# Altium schematic sheet IntegratedShelfControl.SchDoc
size A0
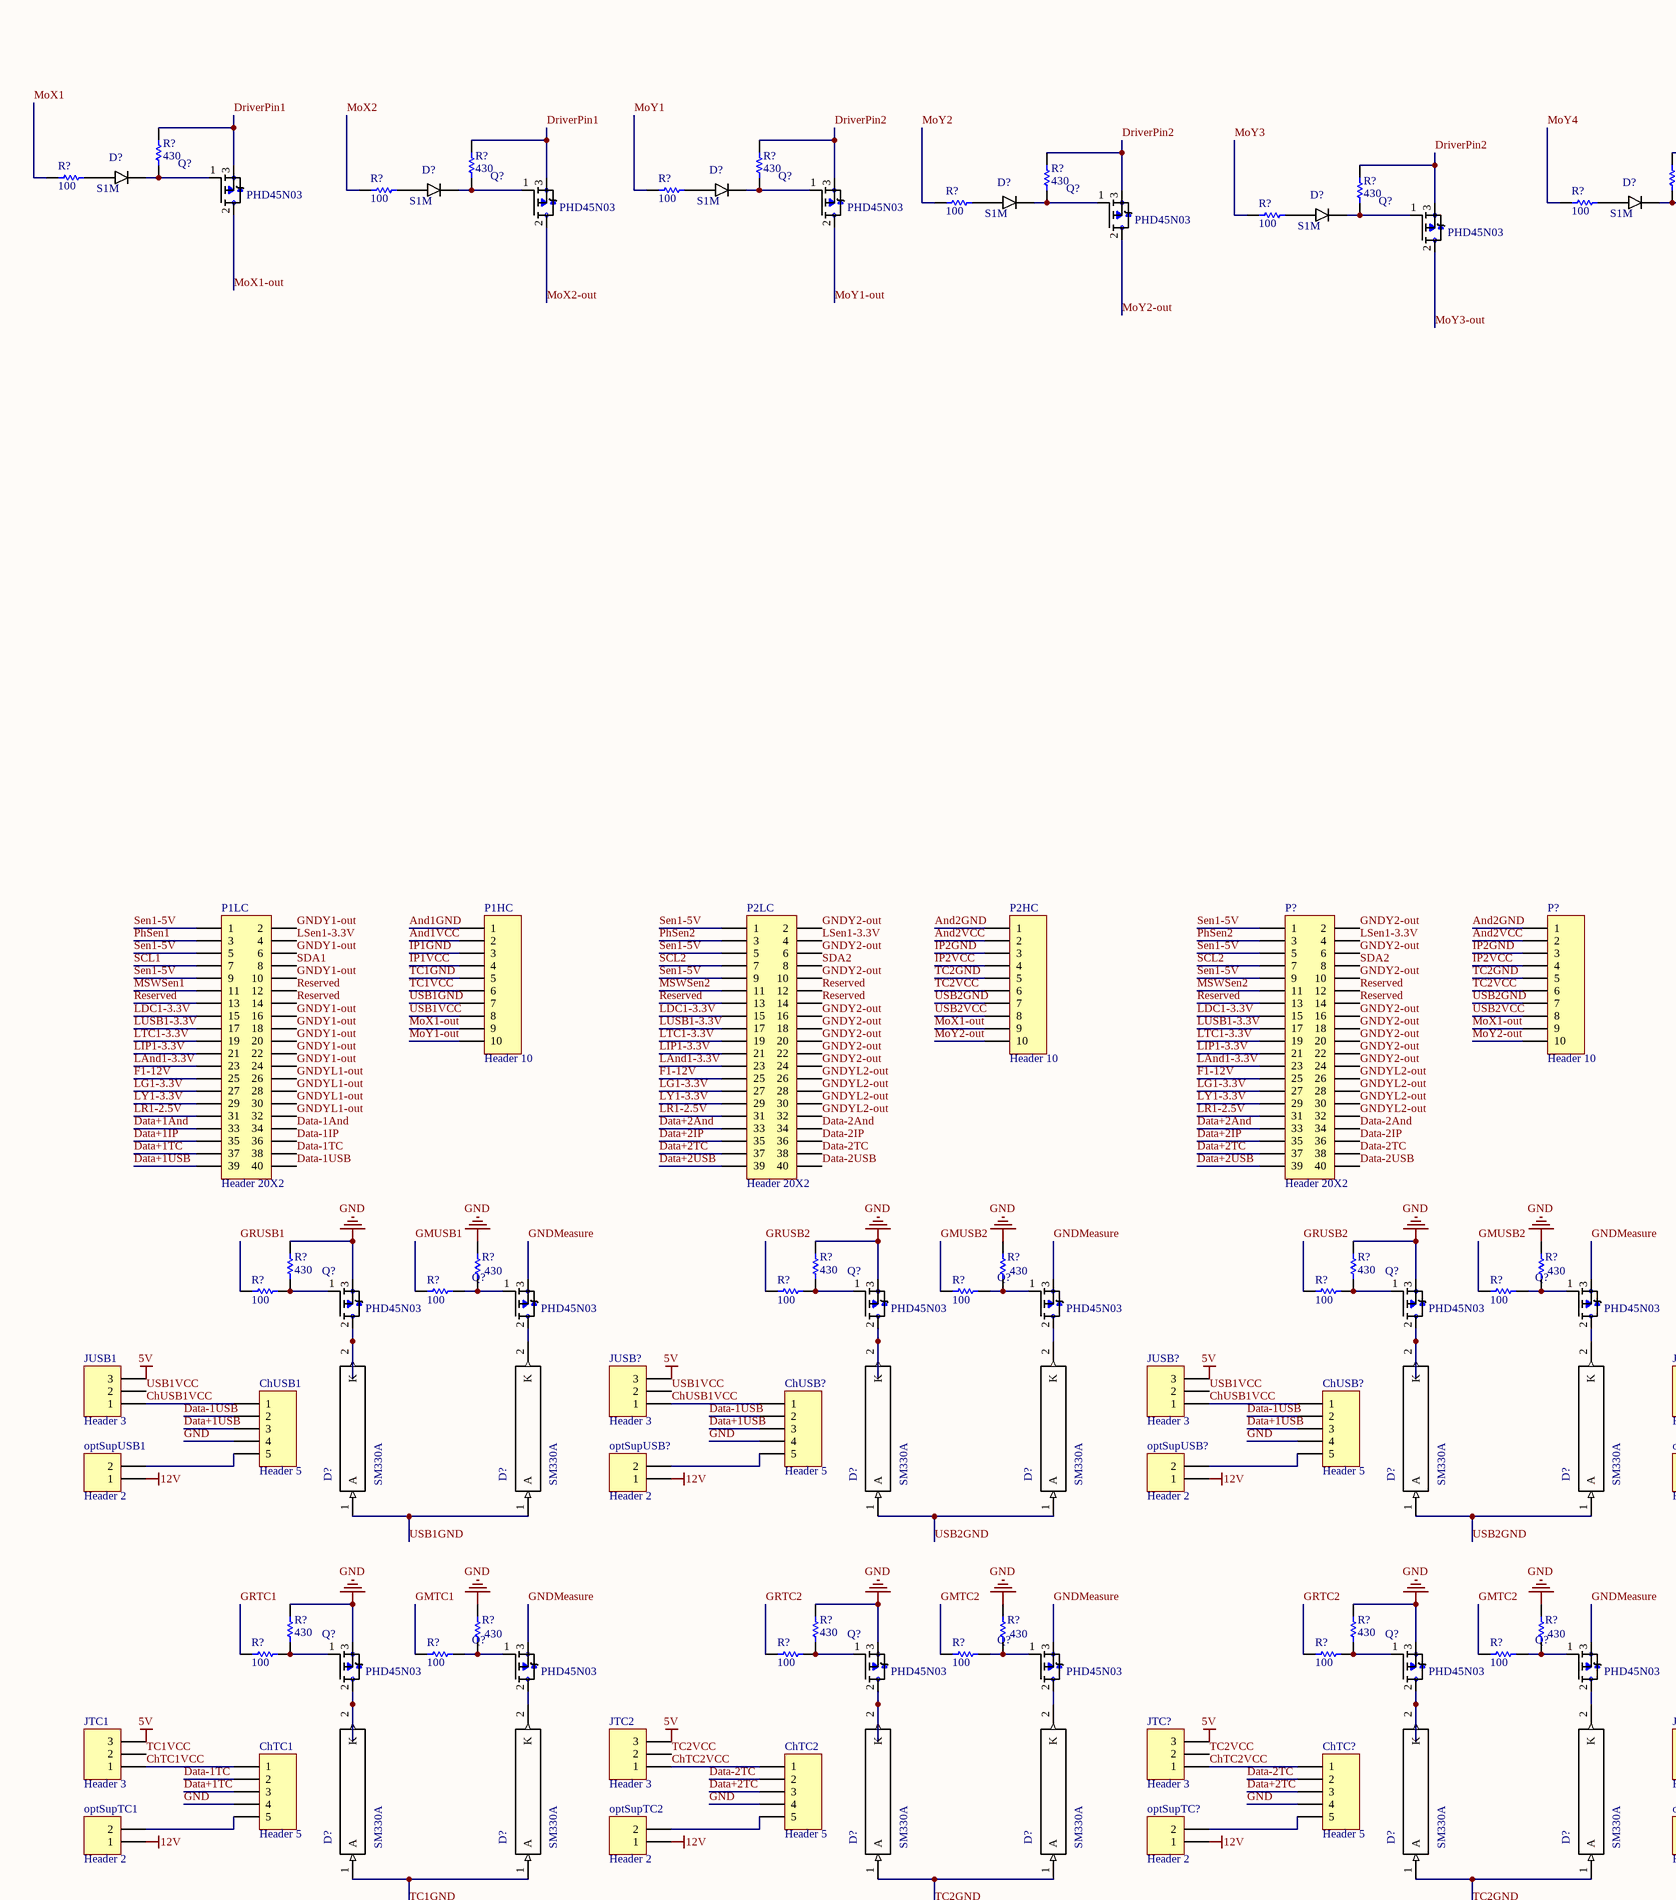
[diagram p0: IntegratedShelfControl.SchDoc, top left]
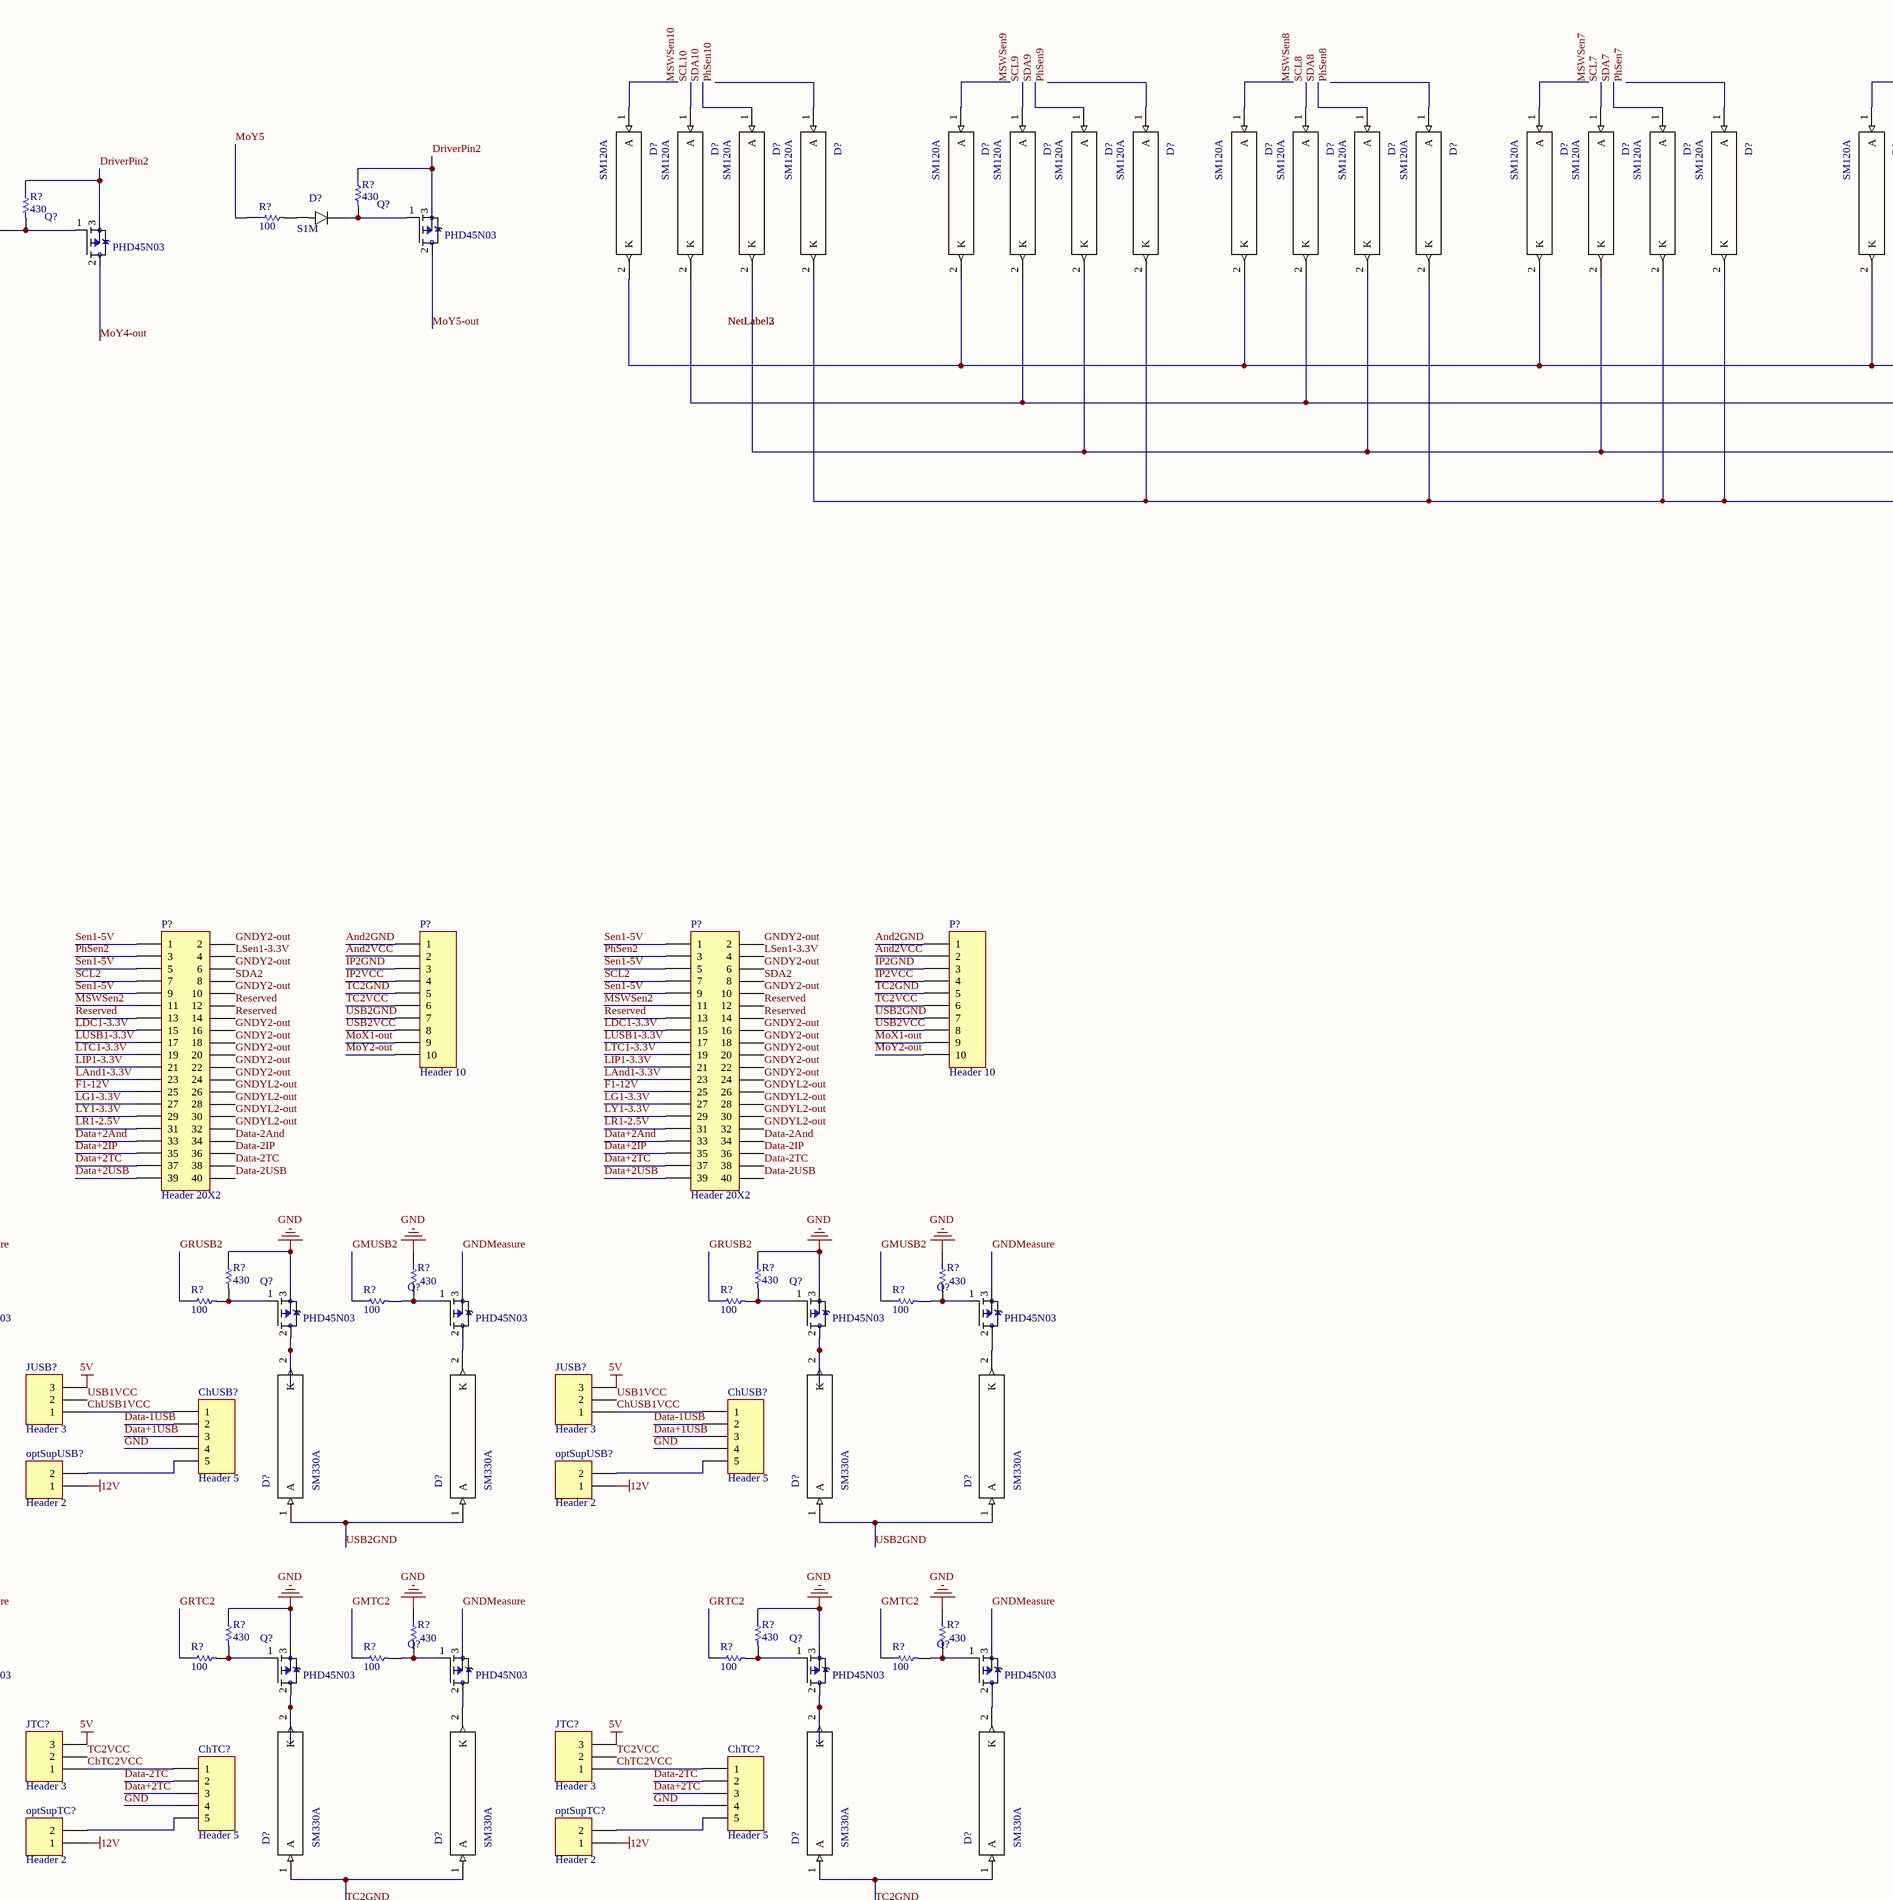
[diagram p1: IntegratedShelfControl.SchDoc, top middle]
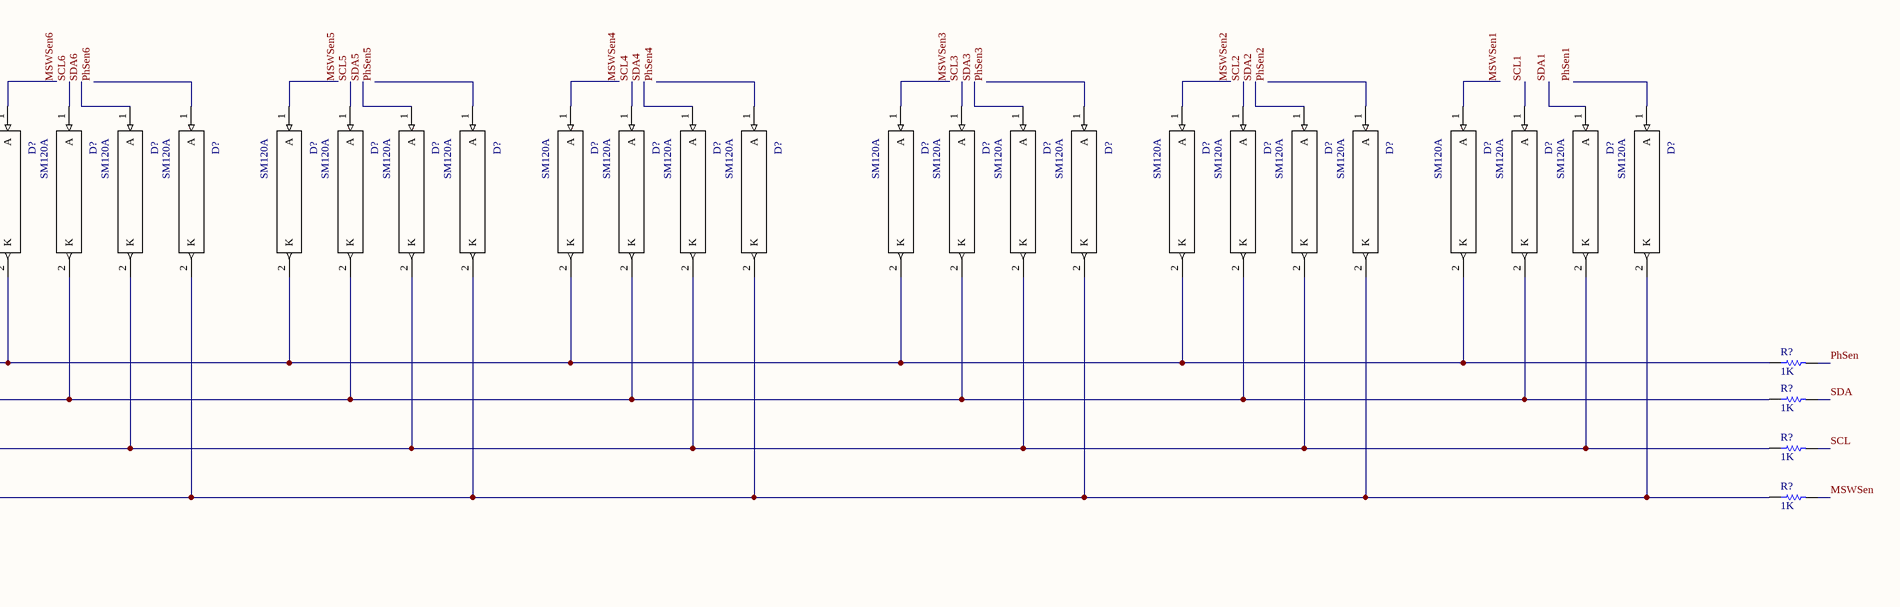
[diagram p2: IntegratedShelfControl.SchDoc, top right]
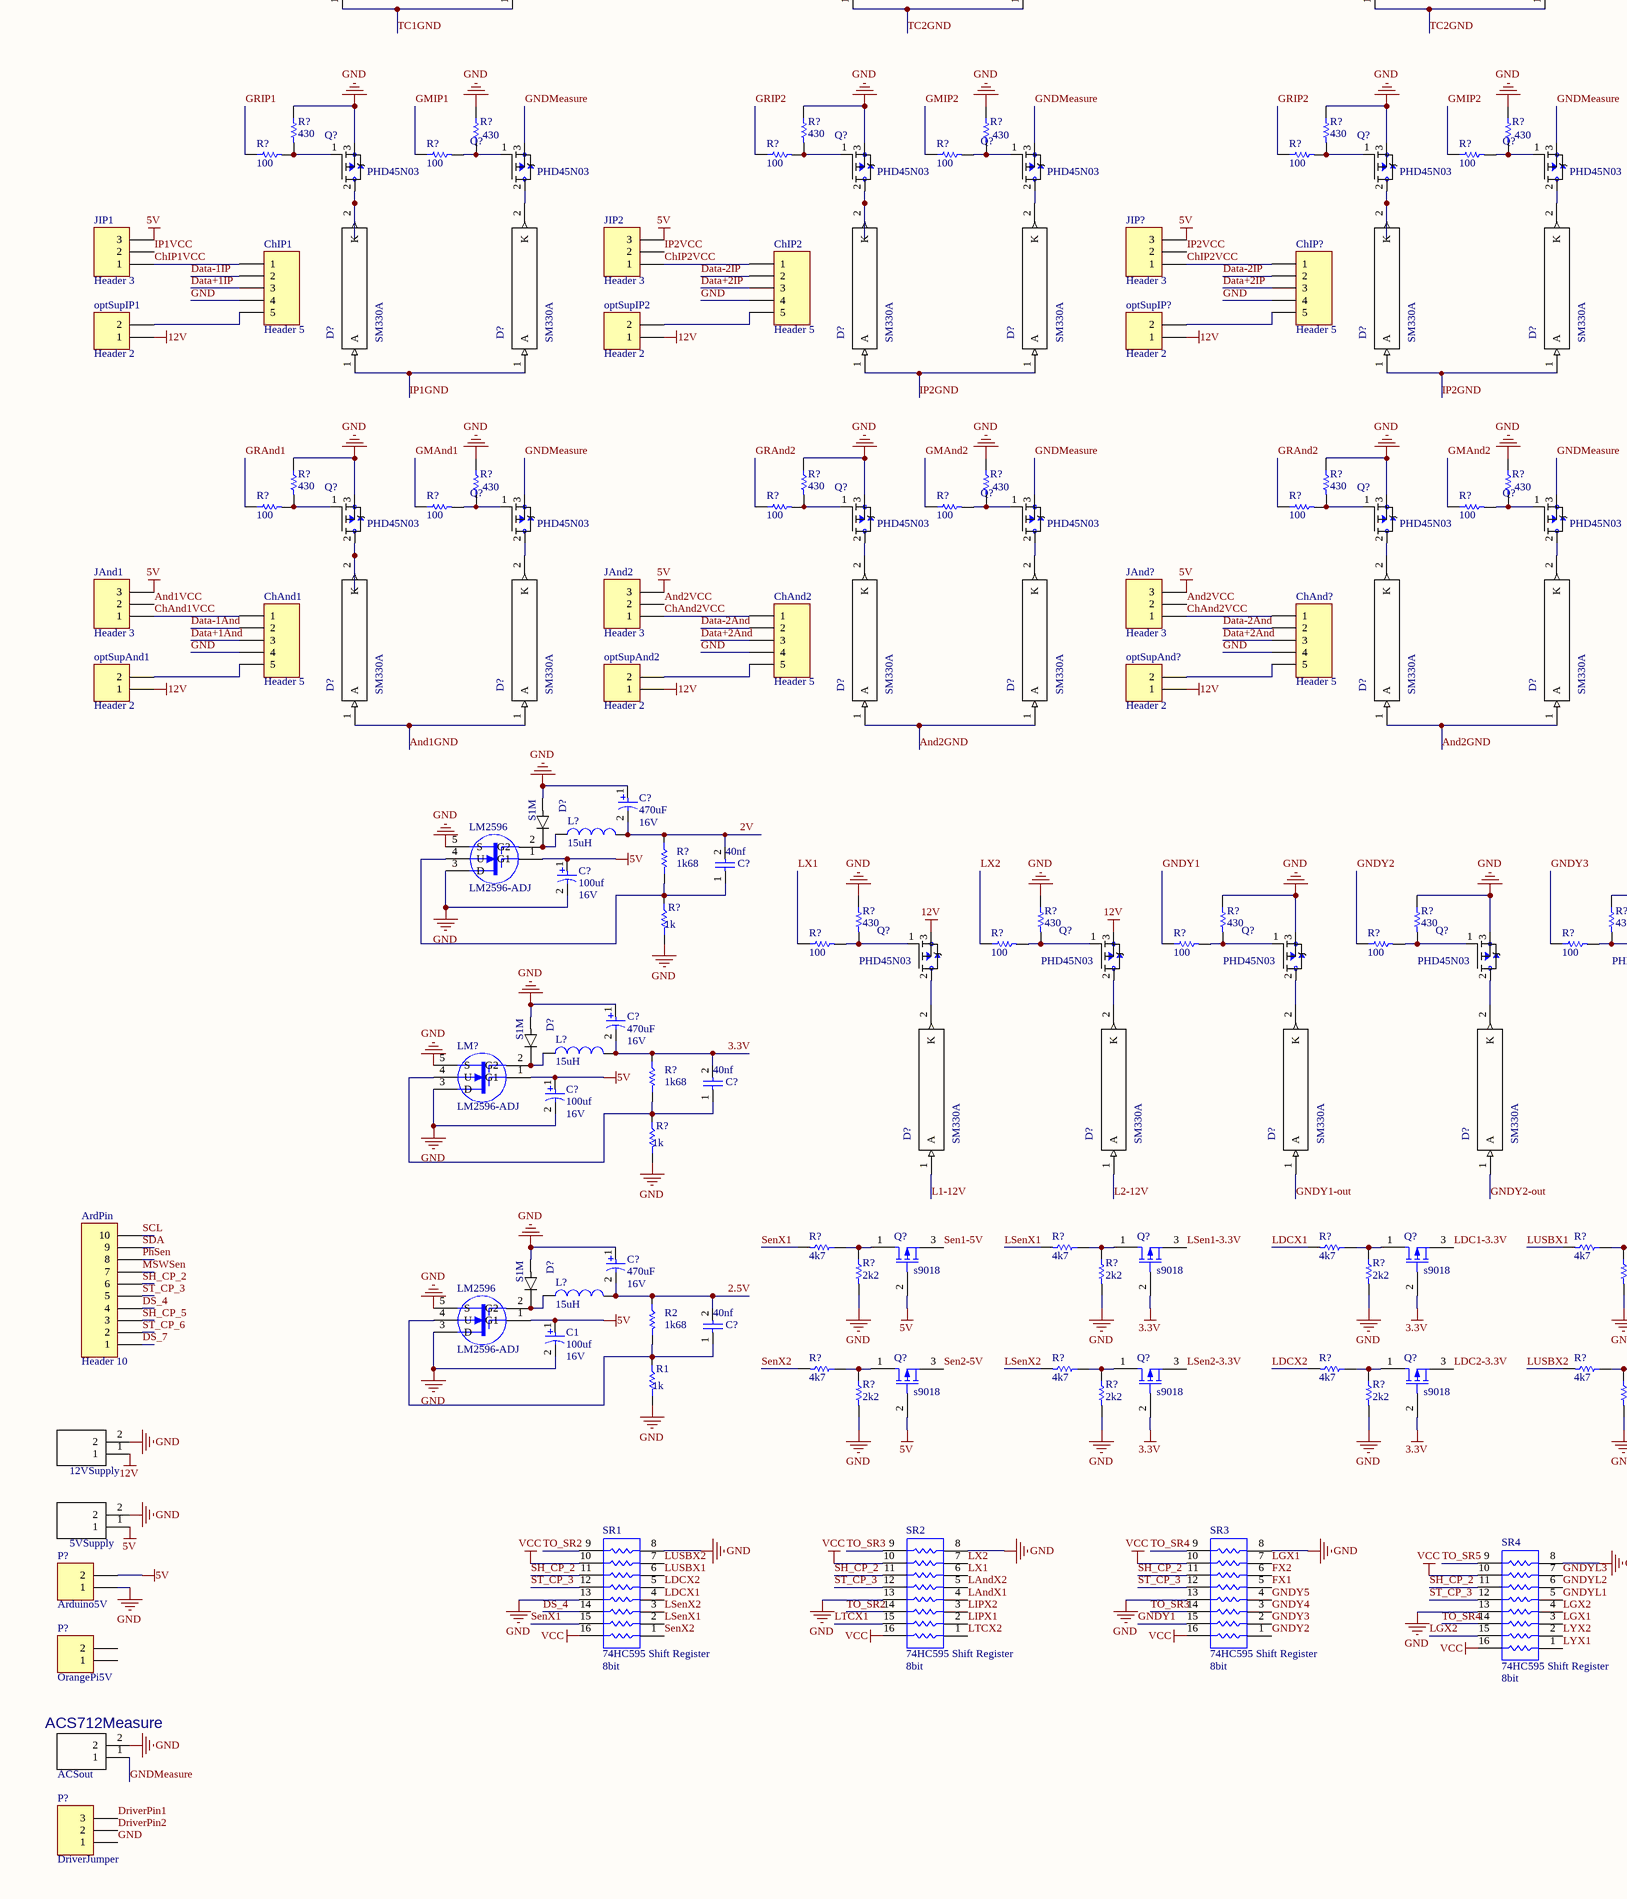
[diagram p3: IntegratedShelfControl.SchDoc, bottom left]
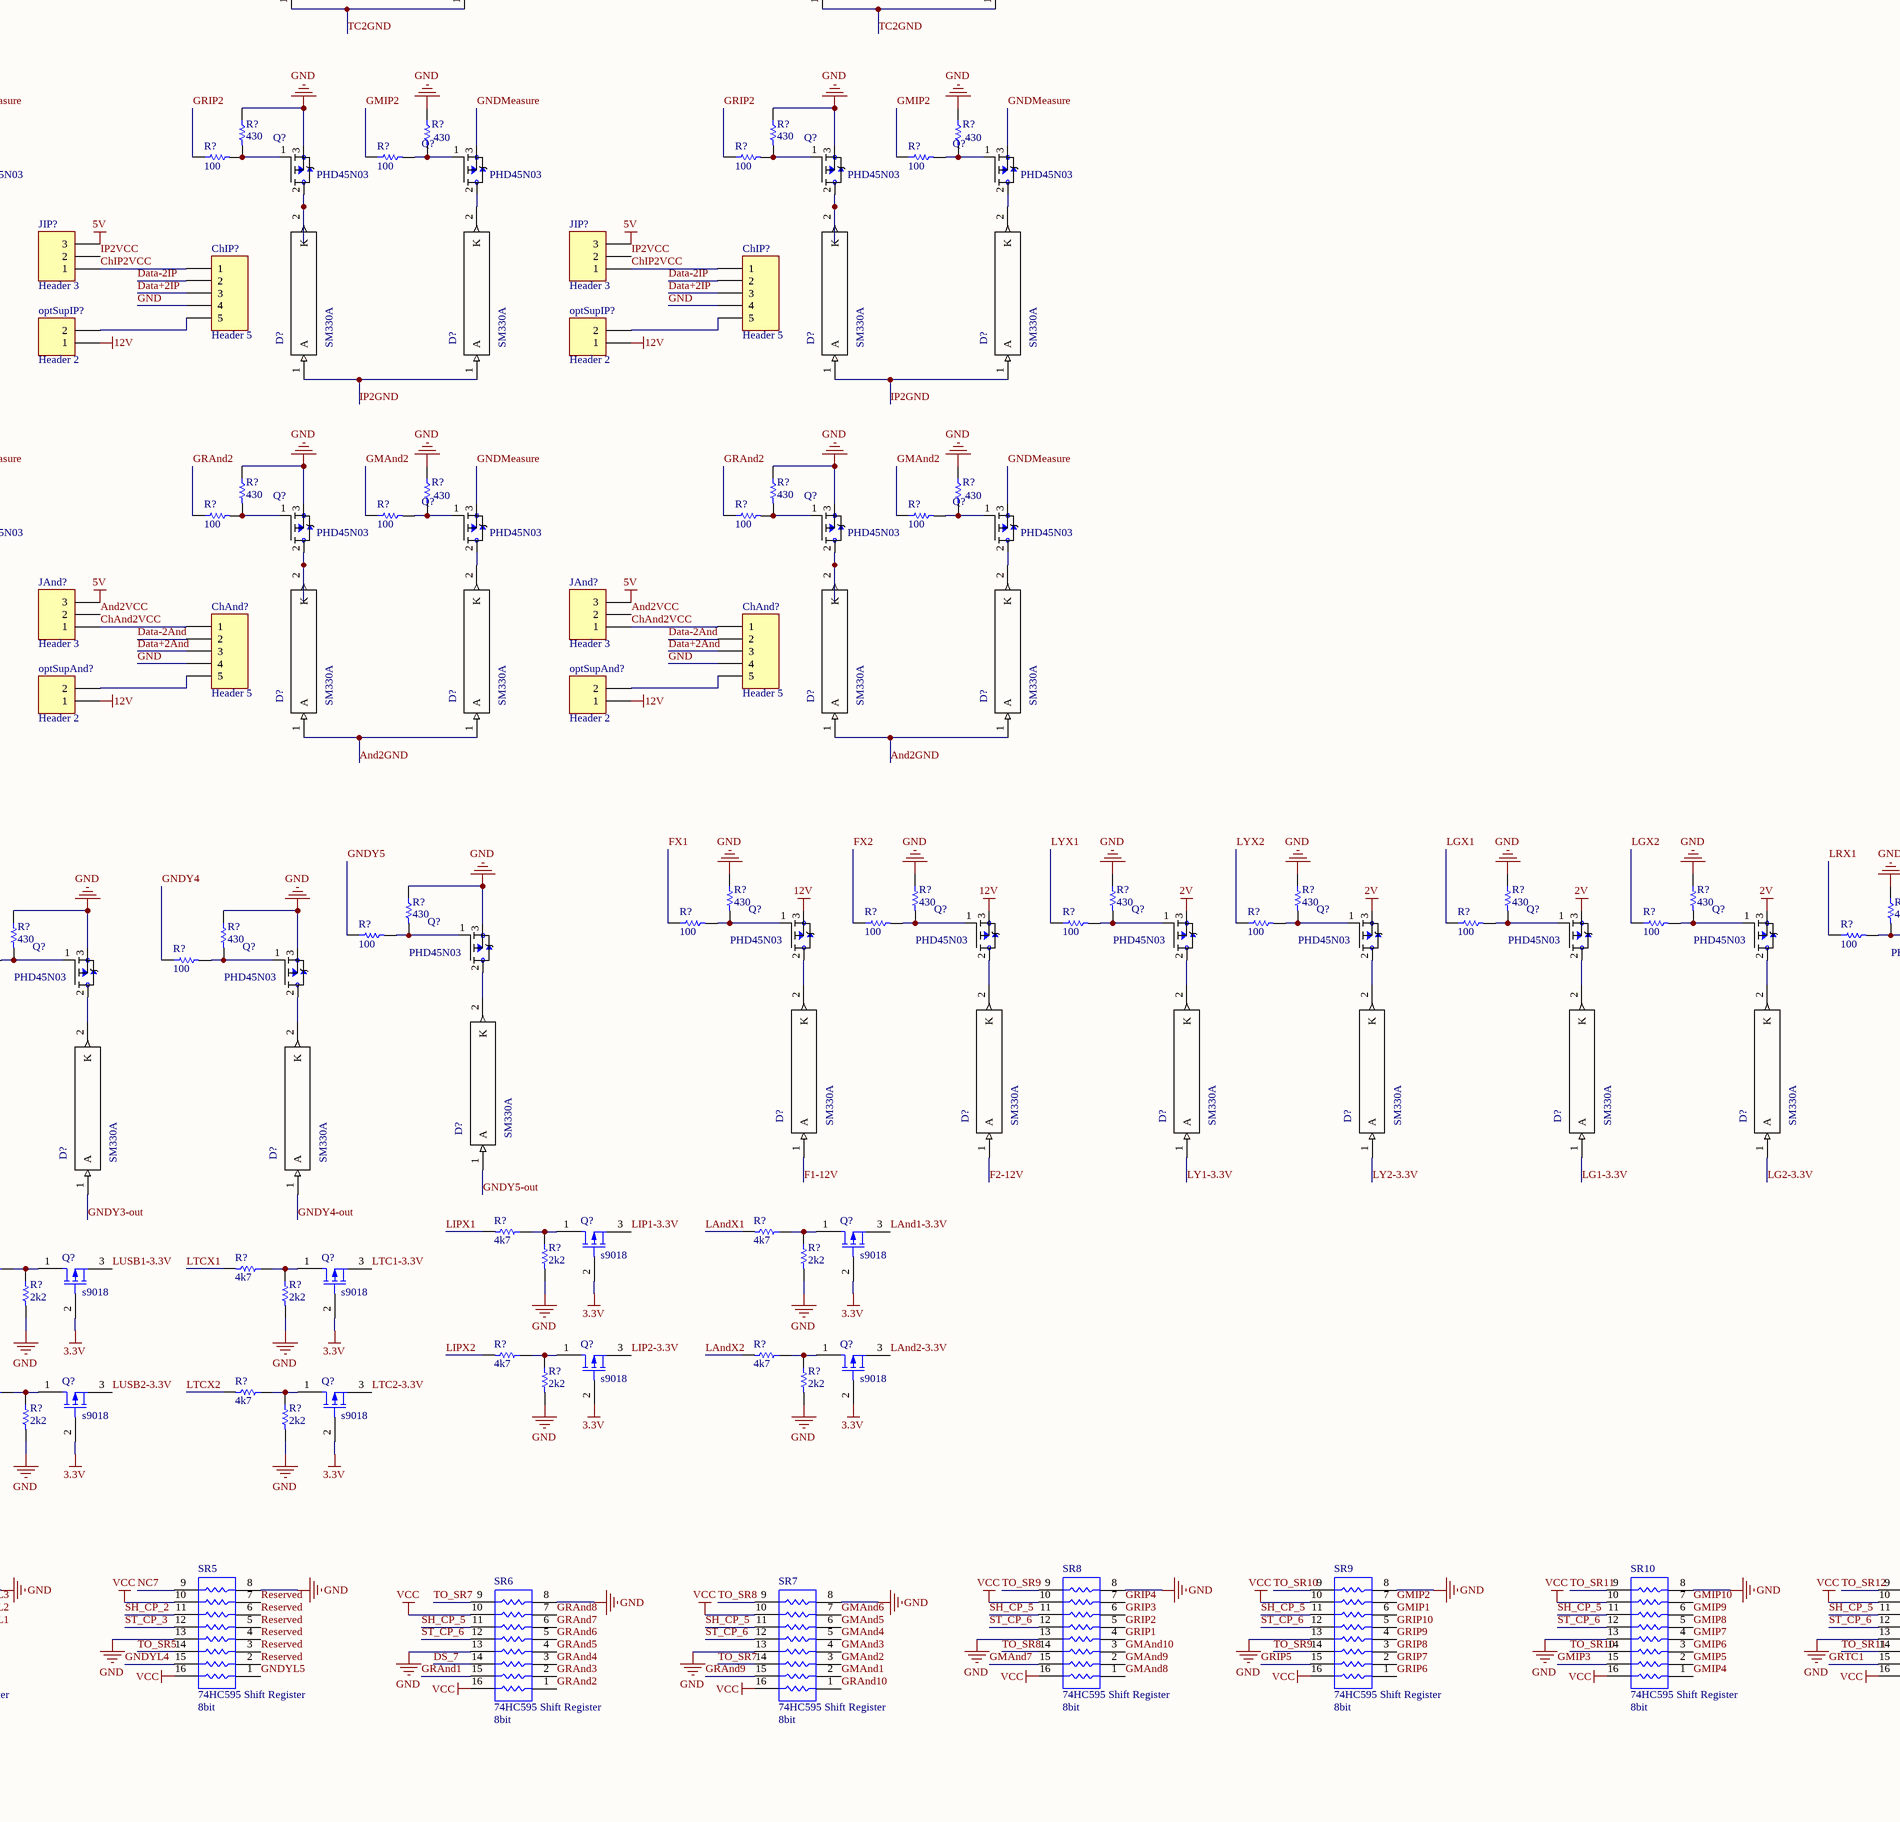
[diagram p4: IntegratedShelfControl.SchDoc, bottom middle]
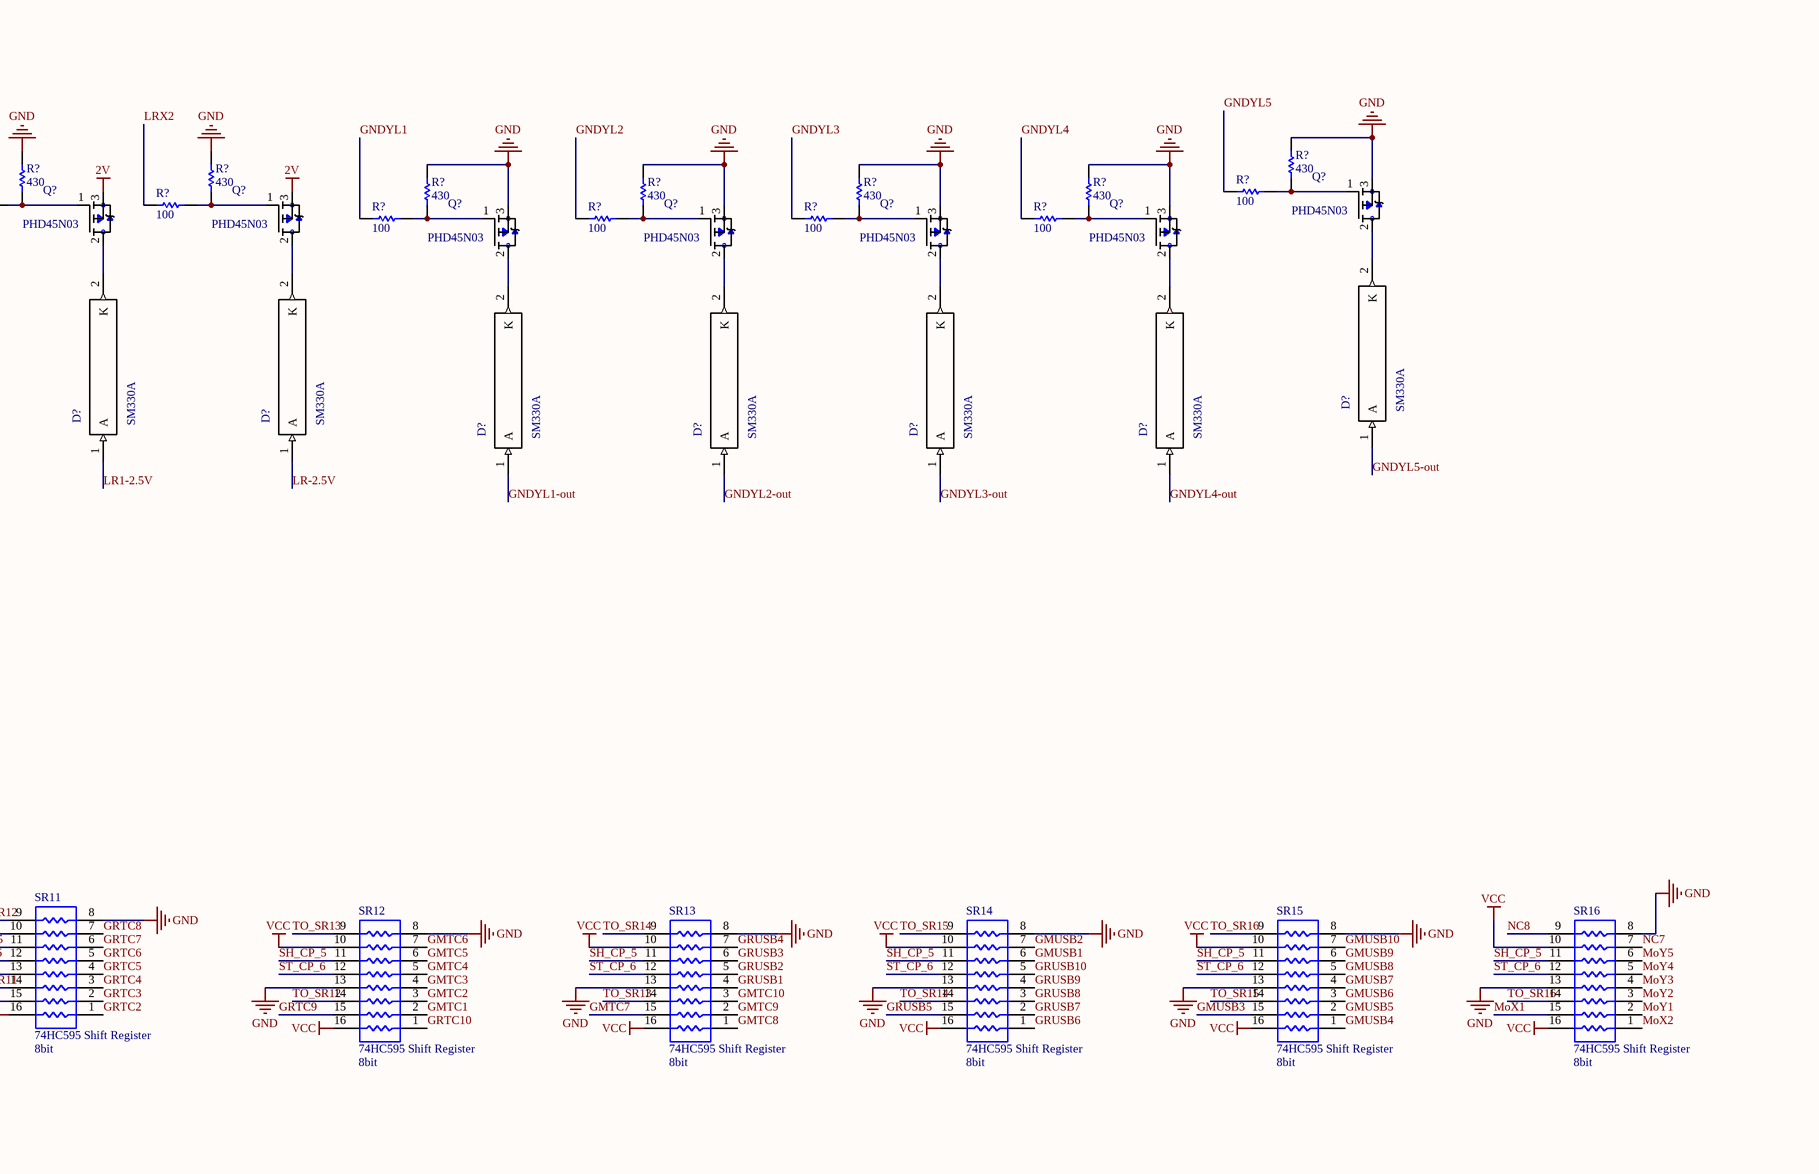
[diagram p5: IntegratedShelfControl.SchDoc, bottom right]

## Parts
(Parts that share a designator on the sheet are numbered #1, #2 ... from top to bottom, then left to right.)
5VSupply  6-1123723-2  [*TE_6-1123723-2]  (value not drawn)
12VSupply  6-1123723-2  [*TE_6-1123723-2]  (value not drawn)
ACSout  ACS712Measure  [*TE_6-1123723-2]
ArdPin  Header 10  [HDR1X10]
C1  100uf  [RB5-10.5]
C?#1  470uF  [RB5-10.5]
C?#2  40nf  [6-0805_L]
C?#3  100uf  [RB5-10.5]
C?#4  470uF  [RB5-10.5]
C?#5  40nf  [6-0805_L]
C?#6  100uf  [RB5-10.5]
C?#7  470uF  [RB5-10.5]
C?#8  40nf  [6-0805_L]
ChAnd1  Header 5  [HDR1X5]
ChAnd2  Header 5  [HDR1X5]
ChAnd?#1  Header 5  [HDR1X5]
ChAnd?#2  Header 5  [HDR1X5]
ChAnd?#3  Header 5  [HDR1X5]
ChIP1  Header 5  [HDR1X5]
ChIP2  Header 5  [HDR1X5]
ChIP?#1  Header 5  [HDR1X5]
ChIP?#2  Header 5  [HDR1X5]
ChIP?#3  Header 5  [HDR1X5]
ChTC1  Header 5  [HDR1X5]
ChTC2  Header 5  [HDR1X5]
ChTC?#1  Header 5  [HDR1X5]
ChTC?#2  Header 5  [HDR1X5]
ChTC?#3  Header 5  [HDR1X5]
ChUSB1  Header 5  [HDR1X5]
ChUSB?#1  Header 5  [HDR1X5]
ChUSB?#2  Header 5  [HDR1X5]
ChUSB?#3  Header 5  [HDR1X5]
ChUSB?#4  Header 5  [HDR1X5]
D?#1  SM120A  [*DIOM5227X270N_S1M(Primary)]
D?#2  SM120A  [*DIOM5227X270N_S1M(Primary)]
D?#3  SM120A  [*DIOM5227X270N_S1M(Primary)]
D?#4  SM120A  [*DIOM5227X270N_S1M(Primary)]
D?#5  SM120A  [*DIOM5227X270N_S1M(Primary)]
D?#6  SM120A  [*DIOM5227X270N_S1M(Primary)]
D?#7  SM120A  [*DIOM5227X270N_S1M(Primary)]
D?#8  SM120A  [*DIOM5227X270N_S1M(Primary)]
D?#9  SM120A  [*DIOM5227X270N_S1M(Primary)]
D?#10  SM120A  [*DIOM5227X270N_S1M(Primary)]
D?#11  SM120A  [*DIOM5227X270N_S1M(Primary)]
D?#12  SM120A  [*DIOM5227X270N_S1M(Primary)]
D?#13  SM120A  [*DIOM5227X270N_S1M(Primary)]
D?#14  SM120A  [*DIOM5227X270N_S1M(Primary)]
D?#15  SM120A  [*DIOM5227X270N_S1M(Primary)]
D?#16  SM120A  [*DIOM5227X270N_S1M(Primary)]
D?#17  SM120A  [*DIOM5227X270N_S1M(Primary)]
D?#18  SM120A  [*DIOM5227X270N_S1M(Primary)]
D?#19  SM120A  [*DIOM5227X270N_S1M(Primary)]
D?#20  SM120A  [*DIOM5227X270N_S1M(Primary)]
D?#21  SM120A  [*DIOM5227X270N_S1M(Primary)]
D?#22  SM120A  [*DIOM5227X270N_S1M(Primary)]
D?#23  SM120A  [*DIOM5227X270N_S1M(Primary)]
D?#24  SM120A  [*DIOM5227X270N_S1M(Primary)]
D?#25  SM120A  [*DIOM5227X270N_S1M(Primary)]
D?#26  SM120A  [*DIOM5227X270N_S1M(Primary)]
D?#27  SM120A  [*DIOM5227X270N_S1M(Primary)]
D?#28  SM120A  [*DIOM5227X270N_S1M(Primary)]
D?#29  SM120A  [*DIOM5227X270N_S1M(Primary)]
D?#30  SM120A  [*DIOM5227X270N_S1M(Primary)]
D?#31  SM120A  [*DIOM5227X270N_S1M(Primary)]
D?#32  SM120A  [*DIOM5227X270N_S1M(Primary)]
D?#33  SM120A  [*DIOM5227X270N_S1M(Primary)]
D?#34  SM120A  [*DIOM5227X270N_S1M(Primary)]
D?#35  SM120A  [*DIOM5227X270N_S1M(Primary)]
D?#36  SM120A  [*DIOM5227X270N_S1M(Primary)]
D?#37  SM120A  [*DIOM5227X270N_S1M(Primary)]
D?#38  SM120A  [*DIOM5227X270N_S1M(Primary)]
D?#39  SM120A  [*DIOM5227X270N_S1M(Primary)]
D?#40  SM120A  [*DIOM5227X270N_S1M(Primary)]
D?#41  S1M  [*DIOM5227X270N_S1M(Primary)]
D?#42  S1M  [*DIOM5227X270N_S1M(Primary)]
D?#43  S1M  [*DIOM5227X270N_S1M(Primary)]
D?#44  S1M  [*DIOM5227X270N_S1M(Primary)]
D?#45  S1M  [*DIOM5227X270N_S1M(Primary)]
D?#46  S1M  [*DIOM5227X270N_S1M(Primary)]
D?#47  S1M  [*DIOM5227X270N_S1M(Primary)]
D?#48  SM330A  [*DIOM5227X270N_S1M(Primary)]
D?#49  SM330A  [*DIOM5227X270N_S1M(Primary)]
D?#50  SM330A  [*DIOM5227X270N_S1M(Primary)]
D?#51  SM330A  [*DIOM5227X270N_S1M(Primary)]
D?#52  SM330A  [*DIOM5227X270N_S1M(Primary)]
D?#53  SM330A  [*DIOM5227X270N_S1M(Primary)]
D?#54  SM330A  [*DIOM5227X270N_S1M(Primary)]
D?#55  SM330A  [*DIOM5227X270N_S1M(Primary)]
D?#56  SM330A  [*DIOM5227X270N_S1M(Primary)]
D?#57  SM330A  [*DIOM5227X270N_S1M(Primary)]
D?#58  SM330A  [*DIOM5227X270N_S1M(Primary)]
D?#59  SM330A  [*DIOM5227X270N_S1M(Primary)]
D?#60  SM330A  [*DIOM5227X270N_S1M(Primary)]
D?#61  SM330A  [*DIOM5227X270N_S1M(Primary)]
D?#62  SM330A  [*DIOM5227X270N_S1M(Primary)]
D?#63  SM330A  [*DIOM5227X270N_S1M(Primary)]
D?#64  SM330A  [*DIOM5227X270N_S1M(Primary)]
D?#65  SM330A  [*DIOM5227X270N_S1M(Primary)]
D?#66  SM330A  [*DIOM5227X270N_S1M(Primary)]
D?#67  SM330A  [*DIOM5227X270N_S1M(Primary)]
D?#68  SM330A  [*DIOM5227X270N_S1M(Primary)]
D?#69  SM330A  [*DIOM5227X270N_S1M(Primary)]
D?#70  SM330A  [*DIOM5227X270N_S1M(Primary)]
D?#71  SM330A  [*DIOM5227X270N_S1M(Primary)]
D?#72  SM330A  [*DIOM5227X270N_S1M(Primary)]
D?#73  SM330A  [*DIOM5227X270N_S1M(Primary)]
D?#74  SM330A  [*DIOM5227X270N_S1M(Primary)]
D?#75  SM330A  [*DIOM5227X270N_S1M(Primary)]
D?#76  SM330A  [*DIOM5227X270N_S1M(Primary)]
D?#77  SM330A  [*DIOM5227X270N_S1M(Primary)]
D?#78  SM330A  [*DIOM5227X270N_S1M(Primary)]
D?#79  SM330A  [*DIOM5227X270N_S1M(Primary)]
D?#80  SM330A  [*DIOM5227X270N_S1M(Primary)]
D?#81  SM330A  [*DIOM5227X270N_S1M(Primary)]
D?#82  SM330A  [*DIOM5227X270N_S1M(Primary)]
D?#83  SM330A  [*DIOM5227X270N_S1M(Primary)]
D?#84  SM330A  [*DIOM5227X270N_S1M(Primary)]
D?#85  SM330A  [*DIOM5227X270N_S1M(Primary)]
D?#86  SM330A  [*DIOM5227X270N_S1M(Primary)]
D?#87  SM330A  [*DIOM5227X270N_S1M(Primary)]
D?#88  S1M  [*DIOM5227X270N_S1M(Primary)]
D?#89  S1M  [*DIOM5227X270N_S1M(Primary)]
D?#90  SM330A  [*DIOM5227X270N_S1M(Primary)]
D?#91  SM330A  [*DIOM5227X270N_S1M(Primary)]
D?#92  SM330A  [*DIOM5227X270N_S1M(Primary)]
D?#93  SM330A  [*DIOM5227X270N_S1M(Primary)]
D?#94  SM330A  [*DIOM5227X270N_S1M(Primary)]
D?#95  SM330A  [*DIOM5227X270N_S1M(Primary)]
D?#96  SM330A  [*DIOM5227X270N_S1M(Primary)]
D?#97  SM330A  [*DIOM5227X270N_S1M(Primary)]
D?#98  SM330A  [*DIOM5227X270N_S1M(Primary)]
D?#99  SM330A  [*DIOM5227X270N_S1M(Primary)]
D?#100  SM330A  [*DIOM5227X270N_S1M(Primary)]
D?#101  SM330A  [*DIOM5227X270N_S1M(Primary)]
D?#102  SM330A  [*DIOM5227X270N_S1M(Primary)]
D?#103  SM330A  [*DIOM5227X270N_S1M(Primary)]
D?#104  SM330A  [*DIOM5227X270N_S1M(Primary)]
D?#105  SM330A  [*DIOM5227X270N_S1M(Primary)]
D?#106  SM330A  [*DIOM5227X270N_S1M(Primary)]
D?#107  SM330A  [*DIOM5227X270N_S1M(Primary)]
D?#108  SM330A  [*DIOM5227X270N_S1M(Primary)]
D?#109  SM330A  [*DIOM5227X270N_S1M(Primary)]
D?#110  S1M  [*DIOM5227X270N_S1M(Primary)]
JAnd1  Header 3  [HDR1X3]
JAnd2  Header 3  [HDR1X3]
JAnd?#1  Header 3  [HDR1X3]
JAnd?#2  Header 3  [HDR1X3]
JAnd?#3  Header 3  [HDR1X3]
JIP1  Header 3  [HDR1X3]
JIP2  Header 3  [HDR1X3]
JIP?#1  Header 3  [HDR1X3]
JIP?#2  Header 3  [HDR1X3]
JIP?#3  Header 3  [HDR1X3]
JTC1  Header 3  [HDR1X3]
JTC2  Header 3  [HDR1X3]
JTC?#1  Header 3  [HDR1X3]
JTC?#2  Header 3  [HDR1X3]
JTC?#3  Header 3  [HDR1X3]
JUSB1  Header 3  [HDR1X3]
JUSB?#1  Header 3  [HDR1X3]
JUSB?#2  Header 3  [HDR1X3]
JUSB?#3  Header 3  [HDR1X3]
JUSB?#4  Header 3  [HDR1X3]
L?#1  15uH  [IND_SMD-13.0mm]
L?#2  15uH  [IND_SMD-13.0mm]
L?#3  15uH  [IND_SMD-13.0mm]
LM2596#1  LM2596-ADJ  [T05A]
LM2596#2  LM2596-ADJ  [T05A]
LM?  LM2596-ADJ  [T05A]
optSupAnd1  Header 2  [HDR1X2]
optSupAnd2  Header 2  [HDR1X2]
optSupAnd?#1  Header 2  [HDR1X2]
optSupAnd?#2  Header 2  [HDR1X2]
optSupAnd?#3  Header 2  [HDR1X2]
optSupIP1  Header 2  [HDR1X2]
optSupIP2  Header 2  [HDR1X2]
optSupIP?#1  Header 2  [HDR1X2]
optSupIP?#2  Header 2  [HDR1X2]
optSupIP?#3  Header 2  [HDR1X2]
optSupTC1  Header 2  [HDR1X2]
optSupTC2  Header 2  [HDR1X2]
optSupTC?#1  Header 2  [HDR1X2]
optSupTC?#2  Header 2  [HDR1X2]
optSupTC?#3  Header 2  [HDR1X2]
optSupUSB1  Header 2  [HDR1X2]
optSupUSB?#1  Header 2  [HDR1X2]
optSupUSB?#2  Header 2  [HDR1X2]
optSupUSB?#3  Header 2  [HDR1X2]
optSupUSB?#4  Header 2  [HDR1X2]
P1HC  Header 10  [HDR1X10]
P1LC  Header 20X2  [HDR2X20]
P2HC  Header 10  [HDR1X10]
P2LC  Header 20X2  [HDR2X20]
P?#1  Header 20X2  [HDR2X20]
P?#2  Header 10  [HDR1X10]
P?#3  Header 20X2  [HDR2X20]
P?#4  Header 10  [HDR1X10]
P?#5  Header 20X2  [HDR2X20]
P?#6  Header 10  [HDR1X10]
P?#7  Arduino5V  [HDR1X2]
P?#8  OrangePi5V  [HDR1X2]
P?#9  DriverJumper  [HDR1X3]
Q?#1  PHD45N03  [*DPAK228P998X235-3N]
Q?#2  PHD45N03  [*DPAK228P998X235-3N]
Q?#3  PHD45N03  [*DPAK228P998X235-3N]
Q?#4  PHD45N03  [*DPAK228P998X235-3N]
Q?#5  PHD45N03  [*DPAK228P998X235-3N]
Q?#6  PHD45N03  [*DPAK228P998X235-3N]
Q?#7  PHD45N03  [*DPAK228P998X235-3N]
Q?#8  PHD45N03  [*DPAK228P998X235-3N]
Q?#9  PHD45N03  [*DPAK228P998X235-3N]
Q?#10  PHD45N03  [*DPAK228P998X235-3N]
Q?#11  PHD45N03  [*DPAK228P998X235-3N]
Q?#12  PHD45N03  [*DPAK228P998X235-3N]
Q?#13  PHD45N03  [*DPAK228P998X235-3N]
Q?#14  PHD45N03  [*DPAK228P998X235-3N]
Q?#15  PHD45N03  [*DPAK228P998X235-3N]
Q?#16  PHD45N03  [*DPAK228P998X235-3N]
Q?#17  PHD45N03  [*DPAK228P998X235-3N]
Q?#18  PHD45N03  [*DPAK228P998X235-3N]
Q?#19  PHD45N03  [*DPAK228P998X235-3N]
Q?#20  PHD45N03  [*DPAK228P998X235-3N]
Q?#21  PHD45N03  [*DPAK228P998X235-3N]
Q?#22  PHD45N03  [*DPAK228P998X235-3N]
Q?#23  PHD45N03  [*DPAK228P998X235-3N]
Q?#24  PHD45N03  [*DPAK228P998X235-3N]
Q?#25  PHD45N03  [*DPAK228P998X235-3N]
Q?#26  PHD45N03  [*DPAK228P998X235-3N]
Q?#27  PHD45N03  [*DPAK228P998X235-3N]
Q?#28  PHD45N03  [*DPAK228P998X235-3N]
Q?#29  PHD45N03  [*DPAK228P998X235-3N]
Q?#30  PHD45N03  [*DPAK228P998X235-3N]
Q?#31  PHD45N03  [*DPAK228P998X235-3N]
Q?#32  PHD45N03  [*DPAK228P998X235-3N]
Q?#33  PHD45N03  [*DPAK228P998X235-3N]
Q?#34  PHD45N03  [*DPAK228P998X235-3N]
Q?#35  PHD45N03  [*DPAK228P998X235-3N]
Q?#36  PHD45N03  [*DPAK228P998X235-3N]
Q?#37  PHD45N03  [*DPAK228P998X235-3N]
Q?#38  PHD45N03  [*DPAK228P998X235-3N]
Q?#39  PHD45N03  [*DPAK228P998X235-3N]
Q?#40  PHD45N03  [*DPAK228P998X235-3N]
Q?#41  PHD45N03  [*DPAK228P998X235-3N]
Q?#42  PHD45N03  [*DPAK228P998X235-3N]
Q?#43  PHD45N03  [*DPAK228P998X235-3N]
Q?#44  PHD45N03  [*DPAK228P998X235-3N]
Q?#45  PHD45N03  [*DPAK228P998X235-3N]
Q?#46  PHD45N03  [*DPAK228P998X235-3N]
Q?#47  PHD45N03  [*DPAK228P998X235-3N]
Q?#48  PHD45N03  [*DPAK228P998X235-3N]
Q?#49  PHD45N03  [*DPAK228P998X235-3N]
Q?#50  PHD45N03  [*DPAK228P998X235-3N]
Q?#51  PHD45N03  [*DPAK228P998X235-3N]
Q?#52  PHD45N03  [*DPAK228P998X235-3N]
Q?#53  PHD45N03  [*DPAK228P998X235-3N]
Q?#54  PHD45N03  [*DPAK228P998X235-3N]
Q?#55  PHD45N03  [*DPAK228P998X235-3N]
Q?#56  PHD45N03  [*DPAK228P998X235-3N]
Q?#57  PHD45N03  [*DPAK228P998X235-3N]
Q?#58  PHD45N03  [*DPAK228P998X235-3N]
Q?#59  PHD45N03  [*DPAK228P998X235-3N]
Q?#60  PHD45N03  [*DPAK228P998X235-3N]
Q?#61  PHD45N03  [*DPAK228P998X235-3N]
Q?#62  PHD45N03  [*DPAK228P998X235-3N]
Q?#63  PHD45N03  [*DPAK228P998X235-3N]
Q?#64  PHD45N03  [*DPAK228P998X235-3N]
Q?#65  PHD45N03  [*DPAK228P998X235-3N]
Q?#66  PHD45N03  [*DPAK228P998X235-3N]
Q?#67  PHD45N03  [*DPAK228P998X235-3N]
Q?#68  s9018  [SOT-23_N]
Q?#69  s9018  [SOT-23_N]
Q?#70  s9018  [SOT-23_N]
Q?#71  s9018  [SOT-23_N]
Q?#72  s9018  [SOT-23_N]
Q?#73  s9018  [SOT-23_N]
Q?#74  s9018  [SOT-23_N]
Q?#75  s9018  [SOT-23_N]
Q?#76  s9018  [SOT-23_N]
Q?#77  s9018  [SOT-23_N]
Q?#78  s9018  [SOT-23_N]
Q?#79  s9018  [SOT-23_N]
Q?#80  s9018  [SOT-23_N]
Q?#81  s9018  [SOT-23_N]
R1  1k  [6-0805_L]
R2  1k68  [6-0805_L]
R?#1  value 430  [6-0805_L]  (hidden comment: R430)
R?#2  value 430  [6-0805_L]  (hidden comment: R430)
R?#3  value 430  [6-0805_L]  (hidden comment: R430)
R?#4  value 430  [6-0805_L]  (hidden comment: R430)
R?#5  value 100  [6-0805_L]  (hidden comment: R100)
R?#6  value 430  [6-0805_L]  (hidden comment: R430)
R?#7  value 430  [6-0805_L]  (hidden comment: R430)
R?#8  value 100  [6-0805_L]  (hidden comment: R100)
R?#9  value 100  [6-0805_L]  (hidden comment: R100)
R?#10  value 430  [6-0805_L]  (hidden comment: R430)
R?#11  value 100  [6-0805_L]  (hidden comment: R100)
R?#12  value 100  [6-0805_L]  (hidden comment: R100)
R?#13  value 100  [6-0805_L]  (hidden comment: R100)
R?#14  value 100  [6-0805_L]  (hidden comment: R100)
R?#15  value 1K  [6-0805_L]  (hidden comment: Res1)
R?#16  value 1K  [6-0805_L]  (hidden comment: Res1)
R?#17  value 1K  [6-0805_L]  (hidden comment: Res1)
R?#18  value 1K  [6-0805_L]  (hidden comment: Res1)
R?#19  value 430  [6-0805_L]  (hidden comment: R430)
R?#20  value 430  [6-0805_L]  (hidden comment: R430)
R?#21  value 430  [6-0805_L]  (hidden comment: R430)
R?#22  value 430  [6-0805_L]  (hidden comment: R430)
R?#23  value 430  [6-0805_L]  (hidden comment: R430)
R?#24  value 430  [6-0805_L]  (hidden comment: R430)
R?#25  value 430  [6-0805_L]  (hidden comment: R430)
R?#26  value 430  [6-0805_L]  (hidden comment: R430)
R?#27  value 430  [6-0805_L]  (hidden comment: R430)
R?#28  value 430  [6-0805_L]  (hidden comment: R430)
R?#29  value 100  [6-0805_L]  (hidden comment: R100)
R?#30  value 100  [6-0805_L]  (hidden comment: R100)
R?#31  value 100  [6-0805_L]  (hidden comment: R100)
R?#32  value 100  [6-0805_L]  (hidden comment: R100)
R?#33  value 100  [6-0805_L]  (hidden comment: R100)
R?#34  value 100  [6-0805_L]  (hidden comment: R100)
R?#35  value 100  [6-0805_L]  (hidden comment: R100)
R?#36  value 100  [6-0805_L]  (hidden comment: R100)
R?#37  value 100  [6-0805_L]  (hidden comment: R100)
R?#38  value 100  [6-0805_L]  (hidden comment: R100)
R?#39  value 430  [6-0805_L]  (hidden comment: R430)
R?#40  value 430  [6-0805_L]  (hidden comment: R430)
R?#41  value 430  [6-0805_L]  (hidden comment: R430)
R?#42  value 430  [6-0805_L]  (hidden comment: R430)
R?#43  value 430  [6-0805_L]  (hidden comment: R430)
R?#44  value 430  [6-0805_L]  (hidden comment: R430)
R?#45  value 430  [6-0805_L]  (hidden comment: R430)
R?#46  value 430  [6-0805_L]  (hidden comment: R430)
R?#47  value 430  [6-0805_L]  (hidden comment: R430)
R?#48  value 430  [6-0805_L]  (hidden comment: R430)
R?#49  value 100  [6-0805_L]  (hidden comment: R100)
R?#50  value 100  [6-0805_L]  (hidden comment: R100)
R?#51  value 100  [6-0805_L]  (hidden comment: R100)
R?#52  value 100  [6-0805_L]  (hidden comment: R100)
R?#53  value 100  [6-0805_L]  (hidden comment: R100)
R?#54  value 100  [6-0805_L]  (hidden comment: R100)
R?#55  value 100  [6-0805_L]  (hidden comment: R100)
R?#56  value 100  [6-0805_L]  (hidden comment: R100)
R?#57  value 100  [6-0805_L]  (hidden comment: R100)
R?#58  value 100  [6-0805_L]  (hidden comment: R100)
R?#59  value 430  [6-0805_L]  (hidden comment: R430)
R?#60  value 430  [6-0805_L]  (hidden comment: R430)
R?#61  value 430  [6-0805_L]  (hidden comment: R430)
R?#62  value 430  [6-0805_L]  (hidden comment: R430)
R?#63  value 430  [6-0805_L]  (hidden comment: R430)
R?#64  value 430  [6-0805_L]  (hidden comment: R430)
R?#65  value 430  [6-0805_L]  (hidden comment: R430)
R?#66  value 430  [6-0805_L]  (hidden comment: R430)
R?#67  value 430  [6-0805_L]  (hidden comment: R430)
R?#68  value 430  [6-0805_L]  (hidden comment: R430)
R?#69  value 100  [6-0805_L]  (hidden comment: R100)
R?#70  value 100  [6-0805_L]  (hidden comment: R100)
R?#71  value 100  [6-0805_L]  (hidden comment: R100)
R?#72  value 100  [6-0805_L]  (hidden comment: R100)
R?#73  value 100  [6-0805_L]  (hidden comment: R100)
R?#74  value 100  [6-0805_L]  (hidden comment: R100)
R?#75  value 100  [6-0805_L]  (hidden comment: R100)
R?#76  value 100  [6-0805_L]  (hidden comment: R100)
R?#77  value 100  [6-0805_L]  (hidden comment: R100)
R?#78  value 100  [6-0805_L]  (hidden comment: R100)
R?#79  value 430  [6-0805_L]  (hidden comment: R430)
R?#80  value 430  [6-0805_L]  (hidden comment: R430)
R?#81  value 430  [6-0805_L]  (hidden comment: R430)
R?#82  value 430  [6-0805_L]  (hidden comment: R430)
R?#83  value 430  [6-0805_L]  (hidden comment: R430)
R?#84  value 430  [6-0805_L]  (hidden comment: R430)
R?#85  value 430  [6-0805_L]  (hidden comment: R430)
R?#86  value 430  [6-0805_L]  (hidden comment: R430)
R?#87  value 430  [6-0805_L]  (hidden comment: R430)
R?#88  value 430  [6-0805_L]  (hidden comment: R430)
R?#89  value 100  [6-0805_L]  (hidden comment: R100)
R?#90  value 100  [6-0805_L]  (hidden comment: R100)
R?#91  value 100  [6-0805_L]  (hidden comment: R100)
R?#92  value 100  [6-0805_L]  (hidden comment: R100)
R?#93  value 100  [6-0805_L]  (hidden comment: R100)
R?#94  value 100  [6-0805_L]  (hidden comment: R100)
R?#95  value 100  [6-0805_L]  (hidden comment: R100)
R?#96  value 100  [6-0805_L]  (hidden comment: R100)
R?#97  value 100  [6-0805_L]  (hidden comment: R100)
R?#98  value 100  [6-0805_L]  (hidden comment: R100)
R?#99  1k68  [6-0805_L]
R?#100  value 430  [6-0805_L]  (hidden comment: R430)
R?#101  value 430  [6-0805_L]  (hidden comment: R430)
R?#102  value 430  [6-0805_L]  (hidden comment: R430)
R?#103  value 430  [6-0805_L]  (hidden comment: R430)
R?#104  value 430  [6-0805_L]  (hidden comment: R430)
R?#105  value 430  [6-0805_L]  (hidden comment: R430)
R?#106  value 430  [6-0805_L]  (hidden comment: R430)
R?#107  value 430  [6-0805_L]  (hidden comment: R430)
R?#108  value 430  [6-0805_L]  (hidden comment: R430)
R?#109  value 430  [6-0805_L]  (hidden comment: R430)
R?#110  value 100  [6-0805_L]  (hidden comment: R100)
R?#111  value 100  [6-0805_L]  (hidden comment: R100)
R?#112  value 100  [6-0805_L]  (hidden comment: R100)
R?#113  value 100  [6-0805_L]  (hidden comment: R100)
R?#114  value 100  [6-0805_L]  (hidden comment: R100)
R?#115  value 100  [6-0805_L]  (hidden comment: R100)
R?#116  value 430  [6-0805_L]  (hidden comment: R430)
R?#117  value 430  [6-0805_L]  (hidden comment: R430)
R?#118  value 430  [6-0805_L]  (hidden comment: R430)
R?#119  value 430  [6-0805_L]  (hidden comment: R430)
R?#120  value 100  [6-0805_L]  (hidden comment: R100)
R?#121  value 430  [6-0805_L]  (hidden comment: R430)
R?#122  value 430  [6-0805_L]  (hidden comment: R430)
R?#123  value 430  [6-0805_L]  (hidden comment: R430)
R?#124  value 430  [6-0805_L]  (hidden comment: R430)
R?#125  value 430  [6-0805_L]  (hidden comment: R430)
R?#126  value 430  [6-0805_L]  (hidden comment: R430)
R?#127  value 100  [6-0805_L]  (hidden comment: R100)
R?#128  value 100  [6-0805_L]  (hidden comment: R100)
R?#129  value 100  [6-0805_L]  (hidden comment: R100)
R?#130  1k  [6-0805_L]
R?#131  value 100  [6-0805_L]  (hidden comment: R100)
R?#132  value 100  [6-0805_L]  (hidden comment: R100)
R?#133  value 100  [6-0805_L]  (hidden comment: R100)
R?#134  value 100  [6-0805_L]  (hidden comment: R100)
R?#135  value 100  [6-0805_L]  (hidden comment: R100)
R?#136  value 100  [6-0805_L]  (hidden comment: R100)
R?#137  value 100  [6-0805_L]  (hidden comment: R100)
R?#138  value 100  [6-0805_L]  (hidden comment: R100)
R?#139  value 100  [6-0805_L]  (hidden comment: R100)
R?#140  value 100  [6-0805_L]  (hidden comment: R100)
R?#141  1k68  [6-0805_L]
R?#142  1k  [6-0805_L]
R?#143  value 4k7  [6-0805_L]  (hidden comment: R4k7)
R?#144  value 2k2  [6-0805_L]  (hidden comment: R2k2)
R?#145  value 4k7  [6-0805_L]  (hidden comment: R4k7)
R?#146  value 2k2  [6-0805_L]  (hidden comment: R2k2)
R?#147  value 4k7  [6-0805_L]  (hidden comment: R4k7)
R?#148  value 2k2  [6-0805_L]  (hidden comment: R2k2)
R?#149  value 4k7  [6-0805_L]  (hidden comment: R4k7)
R?#150  value 2k2  [6-0805_L]  (hidden comment: R2k2)
R?#151  value 4k7  [6-0805_L]  (hidden comment: R4k7)
R?#152  value 2k2  [6-0805_L]  (hidden comment: R2k2)
R?#153  value 4k7  [6-0805_L]  (hidden comment: R4k7)
R?#154  value 2k2  [6-0805_L]  (hidden comment: R2k2)
R?#155  value 4k7  [6-0805_L]  (hidden comment: R4k7)
R?#156  value 2k2  [6-0805_L]  (hidden comment: R2k2)
R?#157  value 4k7  [6-0805_L]  (hidden comment: R4k7)
R?#158  value 2k2  [6-0805_L]  (hidden comment: R2k2)
R?#159  value 4k7  [6-0805_L]  (hidden comment: R4k7)
R?#160  value 2k2  [6-0805_L]  (hidden comment: R2k2)
R?#161  value 4k7  [6-0805_L]  (hidden comment: R4k7)
R?#162  value 2k2  [6-0805_L]  (hidden comment: R2k2)
R?#163  value 4k7  [6-0805_L]  (hidden comment: R4k7)
R?#164  value 2k2  [6-0805_L]  (hidden comment: R2k2)
R?#165  value 4k7  [6-0805_L]  (hidden comment: R4k7)
R?#166  value 2k2  [6-0805_L]  (hidden comment: R2k2)
R?#167  value 4k7  [6-0805_L]  (hidden comment: R4k7)
R?#168  value 2k2  [6-0805_L]  (hidden comment: R2k2)
R?#169  value 4k7  [6-0805_L]  (hidden comment: R4k7)
R?#170  value 2k2  [6-0805_L]  (hidden comment: R2k2)
SR1  74HC595 Shift Register  value 8bit  [SO-16_L]
SR2  74HC595 Shift Register  value 8bit  [SO-16_L]
SR3  74HC595 Shift Register  value 8bit  [SO-16_L]
SR4  74HC595 Shift Register  value 8bit  [SO-16_L]
SR5  74HC595 Shift Register  value 8bit  [SO-16_L]
SR6  74HC595 Shift Register  value 8bit  [SO-16_L]
SR7  74HC595 Shift Register  value 8bit  [SO-16_L]
SR8  74HC595 Shift Register  value 8bit  [SO-16_L]
SR9  74HC595 Shift Register  value 8bit  [SO-16_L]
SR10  74HC595 Shift Register  value 8bit  [SO-16_L]
SR11  74HC595 Shift Register  value 8bit  [SO-16_L]
SR12  74HC595 Shift Register  value 8bit  [SO-16_L]
SR13  74HC595 Shift Register  value 8bit  [SO-16_L]
SR14  74HC595 Shift Register  value 8bit  [SO-16_L]
SR15  74HC595 Shift Register  value 8bit  [SO-16_L]
SR16  74HC595 Shift Register  value 8bit  [SO-16_L]

## Nets
2V: C?#1.2 C?#2.2 L?#1.2 Q?#50.3(S) Q?#51.3(S) Q?#52.3(S) Q?#53.3(S) Q?#56.3(S) Q?#57.3(S) R?#99.1
3.3V: C?#4.2 C?#5.2 L?#2.2 Q?#68.2(G) Q?#69.2(G) Q?#71.2(G) Q?#72.2(G) Q?#73.2(G) Q?#74.2(G) Q?#75.2(G) Q?#76.2(G) Q?#78.2(G) Q?#79.2(G) Q?#80.2(G) Q?#81.2(G) R?#141.1
5V: 5VSupply.1 C1.1 C?#3.1 C?#6.1 JAnd1.3 JAnd2.3 JAnd?#1.3 JAnd?#2.3 JAnd?#3.3 JIP1.3 JIP2.3 JIP?#1.3 JIP?#2.3 JIP?#3.3 JTC1.3 JTC2.3 JTC?#1.3 JTC?#2.3 JTC?#3.3 JUSB1.3 JUSB?#1.3 JUSB?#2.3 JUSB?#3.3 JUSB?#4.3 LM2596#1.1(G1) LM2596#2.1(G1) LM?.1(G1) P?#7.2 Q?#70.2(G) Q?#77.2(G)
12V: 12VSupply.1 optSupAnd1.1 optSupAnd2.1 optSupAnd?#1.1 optSupAnd?#2.1 optSupAnd?#3.1 optSupIP1.1 optSupIP2.1 optSupIP?#1.1 optSupIP?#2.1 optSupIP?#3.1 optSupTC1.1 optSupTC2.1 optSupTC?#1.1 optSupTC?#2.1 optSupTC?#3.1 optSupUSB1.1 optSupUSB?#1.1 optSupUSB?#2.1 optSupUSB?#3.1 optSupUSB?#4.1 Q?#48.3(S) Q?#49.3(S) Q?#62.3(S) Q?#63.3(S)
GND: 5VSupply.2 12VSupply.2 ACSout.2 C1.2 C?#1.1 C?#3.2 C?#4.1 C?#6.2 C?#7.1 ChAnd1.4 ChAnd2.4 ChAnd?#1.4 ChAnd?#2.4 ChAnd?#3.4 ChIP1.4 ChIP2.4 ChIP?#1.4 ChIP?#2.4 ChIP?#3.4 ChTC1.4 ChTC2.4 ChTC?#1.4 ChTC?#2.4 ChTC?#3.4 ChUSB1.4 ChUSB?#1.4 ChUSB?#2.4 ChUSB?#3.4 ChUSB?#4.4 D?#88.A D?#89.A D?#110.A LM2596#1.3(D) LM2596#1.5(S) LM2596#2.3(D) LM2596#2.5(S) LM?.3(D) LM?.5(S) P?#7.1 P?#9.1 Q?#8.3(S) Q?#10.3(S) Q?#12.3(S) Q?#14.3(S) Q?#16.3(S) Q?#18.3(S) Q?#20.3(S) Q?#22.3(S) Q?#24.3(S) Q?#26.3(S) Q?#28.3(S) Q?#30.3(S) Q?#32.3(S) Q?#34.3(S) Q?#36.3(S) Q?#38.3(S) Q?#40.3(S) Q?#42.3(S) Q?#44.3(S) Q?#46.3(S) Q?#54.3(S) Q?#55.3(S) Q?#58.3(S) Q?#59.3(S) Q?#60.3(S) Q?#61.3(S) Q?#64.3(S) Q?#65.3(S) Q?#66.3(S) Q?#67.3(S) R1.2 R?#19.1 R?#20.1 R?#21.1 R?#22.1 R?#23.1 R?#24.1 R?#25.1 R?#26.1 R?#27.1 R?#28.1 R?#39.1 R?#40.1 R?#41.1 R?#42.1 R?#43.1 R?#44.1 R?#45.1 R?#46.1 R?#47.1 R?#48.1 R?#59.1 R?#60.1 R?#61.1 R?#62.1 R?#63.1 R?#64.1 R?#65.1 R?#66.1 R?#67.1 R?#68.1 R?#79.1 R?#80.1 R?#81.1 R?#82.1 R?#83.1 R?#84.1 R?#85.1 R?#86.1 R?#87.1 R?#88.1 R?#100.1 R?#101.1 R?#102.1 R?#103.1 R?#104.1 R?#105.1 R?#106.1 R?#107.1 R?#108.1 R?#109.1 R?#116.1 R?#117.1 R?#118.1 R?#119.1 R?#121.1 R?#122.1 R?#123.1 R?#124.1 R?#125.1 R?#126.1 R?#130.2 R?#142.2 R?#144.2 R?#146.2 R?#148.2 R?#150.2 R?#152.2 R?#154.2 R?#156.2 R?#158.2 R?#160.2 R?#162.2 R?#164.2 R?#166.2 R?#168.2 R?#170.2 SR1.8 SR1.13 SR2.8 SR2.13 SR3.8 SR3.13 SR4.8 SR4.13 SR5.8 SR5.13 SR6.8 SR6.13 SR7.8 SR7.13 SR8.8 SR8.13 SR9.8 SR9.13 SR10.8 SR10.13 SR11.8 SR11.13 SR12.8 SR12.13 SR13.8 SR13.13 SR14.8 SR14.13 SR15.8 SR15.13 SR16.8 SR16.13
VCC: SR1.10 SR1.16 SR2.10 SR2.16 SR3.10 SR3.16 SR4.10 SR4.16 SR5.10 SR5.16 SR6.10 SR6.16 SR7.10 SR7.16 SR8.10 SR8.16 SR9.10 SR9.16 SR10.10 SR10.16 SR11.10 SR11.16 SR12.10 SR12.16 SR13.10 SR13.16 SR14.10 SR14.16 SR15.10 SR15.16 SR16.10 SR16.16
2.5V: C?#7.2 C?#8.2 L?#3.2 R2.1
And1GND: D?#78.1(A) D?#79.1(A) P1HC.1
And1VCC: JAnd1.2 P1HC.2
And2GND: D?#80.1(A) D?#81.1(A) D?#82.1(A) D?#83.1(A) D?#84.1(A) D?#85.1(A) D?#86.1(A) D?#87.1(A) P2HC.1 P?#2.1 P?#4.1 P?#6.1
And2VCC: JAnd2.2 JAnd?#1.2 JAnd?#2.2 JAnd?#3.2 P2HC.2 P?#2.2 P?#4.2 P?#6.2
ChAnd1VCC: ChAnd1.1 JAnd1.1
ChAnd2VCC: ChAnd2.1 ChAnd?#1.1 ChAnd?#2.1 ChAnd?#3.1 JAnd2.1 JAnd?#1.1 JAnd?#2.1 JAnd?#3.1
ChIP1VCC: ChIP1.1 JIP1.1
ChIP2VCC: ChIP2.1 ChIP?#1.1 ChIP?#2.1 ChIP?#3.1 JIP2.1 JIP?#1.1 JIP?#2.1 JIP?#3.1
ChTC1VCC: ChTC1.1 JTC1.1
ChTC2VCC: ChTC2.1 ChTC?#1.1 ChTC?#2.1 ChTC?#3.1 JTC2.1 JTC?#1.1 JTC?#2.1 JTC?#3.1
ChUSB1VCC: ChUSB1.1 ChUSB?#1.1 ChUSB?#2.1 ChUSB?#3.1 ChUSB?#4.1 JUSB1.1 JUSB?#1.1 JUSB?#2.1 JUSB?#3.1 JUSB?#4.1
Data+1And: ChAnd1.3 P1LC.33
Data+1IP: ChIP1.3 P1LC.35
Data+1TC: ChTC1.3 P1LC.37
Data+1USB: ChUSB1.3 ChUSB?#1.3 ChUSB?#2.3 ChUSB?#3.3 ChUSB?#4.3 P1LC.39
Data+2And: ChAnd2.3 ChAnd?#1.3 ChAnd?#2.3 ChAnd?#3.3 P2LC.33 P?#1.33 P?#3.33 P?#5.33
Data+2IP: ChIP2.3 ChIP?#1.3 ChIP?#2.3 ChIP?#3.3 P2LC.35 P?#1.35 P?#3.35 P?#5.35
Data+2TC: ChTC2.3 ChTC?#1.3 ChTC?#2.3 ChTC?#3.3 P2LC.37 P?#1.37 P?#3.37 P?#5.37
Data+2USB: P2LC.39 P?#1.39 P?#3.39 P?#5.39
Data-1And: ChAnd1.2 P1LC.34
Data-1IP: ChIP1.2 P1LC.36
Data-1TC: ChTC1.2 P1LC.38
Data-1USB: ChUSB1.2 ChUSB?#1.2 ChUSB?#2.2 ChUSB?#3.2 ChUSB?#4.2 P1LC.40
Data-2And: ChAnd2.2 ChAnd?#1.2 ChAnd?#2.2 ChAnd?#3.2 P2LC.34 P?#1.34 P?#3.34 P?#5.34
Data-2IP: ChIP2.2 ChIP?#1.2 ChIP?#2.2 ChIP?#3.2 P2LC.36 P?#1.36 P?#3.36 P?#5.36
Data-2TC: ChTC2.2 ChTC?#1.2 ChTC?#2.2 ChTC?#3.2 P2LC.38 P?#1.38 P?#3.38 P?#5.38
Data-2USB: P2LC.40 P?#1.40 P?#3.40 P?#5.40
DriverPin1: P?#9.3 Q?#1.3(S) Q?#2.3(S) R?#1.1 R?#2.1
DriverPin2: P?#9.2 Q?#3.3(S) Q?#4.3(S) Q?#5.3(S) Q?#6.3(S) Q?#7.3(S) R?#3.1 R?#4.1 R?#6.1 R?#7.1 R?#10.1
DS_4: ArdPin.4 SR1.14
DS_7: ArdPin.1 SR6.14
F1-12V: D?#90.1(A) P1LC.25 P2LC.25 P?#1.25 P?#3.25 P?#5.25
F2-12V: D?#91.1(A)
FX1: R?#110.1 SR3.5
FX2: R?#111.1 SR3.6
GMAnd1: R?#90.1 SR7.2
GMAnd2: R?#92.1 R?#94.1 R?#96.1 R?#98.1 SR7.3
GMAnd3: SR7.4
GMAnd4: SR7.5
GMAnd5: SR7.6
GMAnd6: SR7.7
GMAnd7: SR8.15
GMAnd8: SR8.1
GMAnd9: SR8.2
GMAnd10: SR8.3
GMIP1: R?#70.1 SR9.6
GMIP2: R?#72.1 R?#74.1 R?#76.1 R?#78.1 SR9.7
GMIP3: SR10.15
GMIP4: SR10.1
GMIP5: SR10.2
GMIP6: SR10.3
GMIP7: SR10.4
GMIP8: SR10.5
GMIP9: SR10.6
GMIP10: SR10.7
GMTC1: R?#50.1 SR12.2
GMTC2: R?#52.1 R?#54.1 R?#56.1 R?#58.1 SR12.3
GMTC3: SR12.4
GMTC4: SR12.5
GMTC5: SR12.6
GMTC6: SR12.7
GMTC7: SR13.15
GMTC8: SR13.1
GMTC9: SR13.2
GMTC10: SR13.3
GMUSB1: R?#30.1 SR14.6
GMUSB2: R?#32.1 R?#34.1 R?#36.1 R?#38.1 SR14.7
GMUSB3: SR15.15
GMUSB4: SR15.1
GMUSB5: SR15.2
GMUSB6: SR15.3
GMUSB7: SR15.4
GMUSB8: SR15.5
GMUSB9: SR15.6
GMUSB10: SR15.7
GNDMeasure: ACSout.1 Q?#9.3(S) Q?#11.3(S) Q?#13.3(S) Q?#15.3(S) Q?#17.3(S) Q?#19.3(S) Q?#21.3(S) Q?#23.3(S) Q?#25.3(S) Q?#27.3(S) Q?#29.3(S) Q?#31.3(S) Q?#33.3(S) Q?#35.3(S) Q?#37.3(S) Q?#39.3(S) Q?#41.3(S) Q?#43.3(S) Q?#45.3(S) Q?#47.3(S)
GNDY1: R?#137.1 SR3.15
GNDY1-out: D?#106.1(A) P1LC.2 P1LC.6 P1LC.10 P1LC.16 P1LC.18 P1LC.20 P1LC.22 P1LC.24
GNDY2: R?#138.1 SR3.1
GNDY2-out: D?#107.1(A) P2LC.2 P2LC.6 P2LC.10 P2LC.16 P2LC.18 P2LC.20 P2LC.22 P2LC.24 P?#1.2 P?#1.6 P?#1.10 P?#1.16 P?#1.18 P?#1.20 P?#1.22 P?#1.24 P?#3.2 P?#3.6 P?#3.10 P?#3.16 P?#3.18 P?#3.20 P?#3.22 P?#3.24 P?#5.2 P?#5.6 P?#5.10 P?#5.16 P?#5.18 P?#5.20 P?#5.22 P?#5.24
GNDY3: R?#139.1 SR3.2
GNDY3-out: D?#108.1(A)
GNDY4: R?#140.1 SR3.3
GNDY4-out: D?#109.1(A)
GNDY5: R?#127.1 SR3.4
GNDY5-out: D?#97.1(A)
GNDYL1: R?#131.1 SR4.5
GNDYL1-out: D?#100.1(A) P1LC.26 P1LC.28 P1LC.30 P1LC.32
GNDYL2: R?#132.1 SR4.6
GNDYL2-out: D?#101.1(A) P2LC.26 P2LC.28 P2LC.30 P2LC.32 P?#1.26 P?#1.28 P?#1.30 P?#1.32 P?#3.26 P?#3.28 P?#3.30 P?#3.32 P?#5.26 P?#5.28 P?#5.30 P?#5.32
GNDYL3: R?#133.1 SR4.7
GNDYL3-out: D?#102.1(A)
GNDYL4: R?#134.1 SR5.15
GNDYL4-out: D?#103.1(A)
GNDYL5: R?#120.1 SR5.1
GNDYL5-out: D?#96.1(A)
GRAnd1: R?#89.1 SR6.15
GRAnd2: R?#91.1 R?#93.1 R?#95.1 R?#97.1 SR6.1
GRAnd3: SR6.2
GRAnd4: SR6.3
GRAnd5: SR6.4
GRAnd6: SR6.5
GRAnd7: SR6.6
GRAnd8: SR6.7
GRAnd9: SR7.15
GRAnd10: SR7.1
GRIP1: R?#69.1 SR8.4
GRIP2: R?#71.1 R?#73.1 R?#75.1 R?#77.1 SR8.5
GRIP3: SR8.6
GRIP4: SR8.7
GRIP5: SR9.15
GRIP6: SR9.1
GRIP7: SR9.2
GRIP8: SR9.3
GRIP9: SR9.4
GRIP10: SR9.5
GRTC1: R?#49.1 SR11.15
GRTC2: R?#51.1 R?#53.1 R?#55.1 R?#57.1 SR11.1
GRTC3: SR11.2
GRTC4: SR11.3
GRTC5: SR11.4
GRTC6: SR11.5
GRTC7: SR11.6
GRTC8: SR11.7
GRTC9: SR12.15
GRTC10: SR12.1
GRUSB1: R?#29.1 SR13.4
GRUSB2: R?#31.1 R?#33.1 R?#35.1 R?#37.1 SR13.5
GRUSB3: SR13.6
GRUSB4: SR13.7
GRUSB5: SR14.15
GRUSB6: SR14.1
GRUSB7: SR14.2
GRUSB8: SR14.3
GRUSB9: SR14.4
GRUSB10: SR14.5
IP1GND: D?#68.1(A) D?#69.1(A) P1HC.3
IP1VCC: JIP1.2 P1HC.4
IP2GND: D?#70.1(A) D?#71.1(A) D?#72.1(A) D?#73.1(A) D?#74.1(A) D?#75.1(A) D?#76.1(A) D?#77.1(A) P2HC.3 P?#2.3 P?#4.3 P?#6.3
IP2VCC: JIP2.2 JIP?#1.2 JIP?#2.2 JIP?#3.2 P2HC.4 P?#2.4 P?#4.4 P?#6.4
L1-12V: D?#104.1(A)
L2-12V: D?#105.1(A)
LAnd1-3.3V: P1LC.23 P2LC.23 P?#1.23 P?#3.23 P?#5.23 Q?#69.3(S)
LAnd2-3.3V: Q?#76.3(S)
LAndX1: R?#145.2 SR2.4
LAndX2: R?#159.2 SR2.5
LDC1-3.3V: P1LC.15 P2LC.15 P?#1.15 P?#3.15 P?#5.15 Q?#72.3(S)
LDC2-3.3V: Q?#79.3(S)
LDCX1: R?#151.2 SR1.4
LDCX2: R?#165.2 SR1.5
LG1-3.3V: D?#94.1(A) P1LC.27 P2LC.27 P?#1.27 P?#3.27 P?#5.27
LG2-3.3V: D?#95.1(A)
LGX1: R?#114.1 SR3.7 SR4.3
LGX2: R?#115.1 SR4.4 SR4.15
LIP1-3.3V: P1LC.21 P2LC.21 P?#1.21 P?#3.21 P?#5.21 Q?#68.3(S)
LIP2-3.3V: Q?#75.3(S)
LIPX1: R?#143.2 SR2.2
LIPX2: R?#157.2 SR2.3
LR1-2.5V: D?#98.1(A) P1LC.31 P2LC.31 P?#1.31 P?#3.31 P?#5.31
LR-2.5V: D?#99.1(A)
LRX1: R?#128.1
LRX2: R?#129.1
LSen1-3.3V: P1LC.4 P2LC.4 P?#1.4 P?#3.4 P?#5.4 Q?#71.3(S)
LSen2-3.3V: Q?#78.3(S)
LSenX1: R?#149.2 SR1.2
LSenX2: R?#163.2 SR1.3
LTC1-3.3V: P1LC.19 P2LC.19 P?#1.19 P?#3.19 P?#5.19 Q?#74.3(S)
LTC2-3.3V: Q?#81.3(S)
LTCX1: R?#155.2 SR2.15
LTCX2: R?#169.2 SR2.1
LUSB1-3.3V: P1LC.17 P2LC.17 P?#1.17 P?#3.17 P?#5.17 Q?#73.3(S)
LUSB2-3.3V: Q?#80.3(S)
LUSBX1: R?#153.2 SR1.6
LUSBX2: R?#167.2 SR1.7
LX1: R?#135.1 SR2.6
LX2: R?#136.1 SR2.7
LY1-3.3V: D?#92.1(A) P1LC.29 P2LC.29 P?#1.29 P?#3.29 P?#5.29
LY2-3.3V: D?#93.1(A)
LYX1: R?#112.1 SR4.1
LYX2: R?#113.1 SR4.2
MoX1: R?#5.1 SR16.15
MoX1-out: P1HC.9 P2HC.9 P?#2.9 P?#4.9 P?#6.9 Q?#1.2(D)
MoX2: R?#8.1 SR16.1
MoX2-out: Q?#2.2(D)
MoY1: R?#9.1 SR16.2
MoY1-out: P1HC.10 Q?#3.2(D)
MoY2: R?#12.1 SR16.3
MoY2-out: P2HC.10 P?#2.10 P?#4.10 P?#6.10 Q?#5.2(D)
MoY3: R?#14.1 SR16.4
MoY3-out: Q?#7.2(D)
MoY4: R?#13.1 SR16.5
MoY4-out: Q?#6.2(D)
MoY5: R?#11.1 SR16.6
MoY5-out: Q?#4.2(D)
MSWSen: ArdPin.7 R?#18.2
MSWSen1: D?#37.1(A) P1LC.11
MSWSen2: D?#33.1(A) P2LC.11 P?#1.11 P?#3.11 P?#5.11
MSWSen3: D?#29.1(A)
MSWSen4: D?#25.1(A)
MSWSen5: D?#21.1(A)
MSWSen6: D?#17.1(A)
MSWSen7: D?#13.1(A)
MSWSen8: D?#9.1(A)
MSWSen9: D?#5.1(A)
MSWSen10: D?#1.1(A)
NC7: SR5.9 SR16.7
NC8: SR16.9
PhSen: ArdPin.8 R?#15.2
PhSen1: D?#40.1(A) P1LC.3
PhSen2: D?#36.1(A) P2LC.3 P?#1.3 P?#3.3 P?#5.3
PhSen3: D?#32.1(A)
PhSen4: D?#28.1(A)
PhSen5: D?#24.1(A)
PhSen6: D?#20.1(A)
PhSen7: D?#16.1(A)
PhSen8: D?#12.1(A)
PhSen9: D?#8.1(A)
PhSen10: D?#4.1(A)
Reserved: P1LC.12 P1LC.13 P1LC.14 P2LC.12 P2LC.13 P2LC.14 P?#1.12 P?#1.13 P?#1.14 P?#3.12 P?#3.13 P?#3.14 P?#5.12 P?#5.13 P?#5.14 SR5.2 SR5.3 SR5.4 SR5.5 SR5.6 SR5.7
SCL: ArdPin.10 R?#17.2
SCL1: D?#38.1(A) P1LC.7
SCL2: D?#34.1(A) P2LC.7 P?#1.7 P?#3.7 P?#5.7
SCL3: D?#30.1(A)
SCL4: D?#26.1(A)
SCL5: D?#22.1(A)
SCL6: D?#18.1(A)
SCL7: D?#14.1(A)
SCL8: D?#10.1(A)
SCL9: D?#6.1(A)
SCL10: D?#2.1(A)
SDA: ArdPin.9 R?#16.2
SDA1: D?#39.1(A) P1LC.8
SDA2: D?#35.1(A) P2LC.8 P?#1.8 P?#3.8 P?#5.8
SDA3: D?#31.1(A)
SDA4: D?#27.1(A)
SDA5: D?#23.1(A)
SDA6: D?#19.1(A)
SDA7: D?#15.1(A)
SDA8: D?#11.1(A)
SDA9: D?#7.1(A)
SDA10: D?#3.1(A)
Sen1-5V: P1LC.1 P1LC.5 P1LC.9 P2LC.1 P2LC.5 P2LC.9 P?#1.1 P?#1.5 P?#1.9 P?#3.1 P?#3.5 P?#3.9 P?#5.1 P?#5.5 P?#5.9 Q?#70.3(S)
Sen2-5V: Q?#77.3(S)
SenX1: R?#147.2 SR1.15
SenX2: R?#161.2 SR1.1
SH_CP_2: ArdPin.6 SR1.11 SR2.11 SR3.11 SR4.11 SR5.11
SH_CP_5: ArdPin.3 SR6.11 SR7.11 SR8.11 SR9.11 SR10.11 SR11.11 SR12.11 SR13.11 SR14.11 SR15.11 SR16.11
ST_CP_3: ArdPin.5 SR1.12 SR2.12 SR3.12 SR4.12 SR5.12
ST_CP_6: ArdPin.2 SR6.12 SR7.12 SR8.12 SR9.12 SR10.12 SR11.12 SR12.12 SR13.12 SR14.12 SR15.12 SR16.12
TC1GND: D?#58.1(A) D?#59.1(A) P1HC.5
TC1VCC: JTC1.2 P1HC.6
TC2GND: D?#60.1(A) D?#61.1(A) D?#62.1(A) D?#63.1(A) D?#64.1(A) D?#65.1(A) D?#66.1(A) D?#67.1(A) P2HC.5 P?#2.5 P?#4.5 P?#6.5
TC2VCC: JTC2.2 JTC?#1.2 JTC?#2.2 JTC?#3.2 P2HC.6 P?#2.6 P?#4.6 P?#6.6
TO_SR2: SR1.9 SR2.14
TO_SR3: SR2.9 SR3.14
TO_SR4: SR3.9 SR4.14
TO_SR5: SR4.9 SR5.14
TO_SR7: SR6.9 SR7.14
TO_SR8: SR7.9 SR8.14
TO_SR9: SR8.9 SR9.14
TO_SR10: SR9.9 SR10.14
TO_SR11: SR10.9 SR11.14
TO_SR12: SR11.9 SR12.14
TO_SR13: SR12.9 SR13.14
TO_SR14: SR13.9 SR14.14
TO_SR15: SR14.9 SR15.14
TO_SR16: SR15.9 SR16.14
USB1GND: D?#48.1(A) D?#49.1(A) P1HC.7
USB1VCC: JUSB1.2 JUSB?#1.2 JUSB?#2.2 JUSB?#3.2 JUSB?#4.2 P1HC.8
USB2GND: D?#50.1(A) D?#51.1(A) D?#52.1(A) D?#53.1(A) D?#54.1(A) D?#55.1(A) D?#56.1(A) D?#57.1(A) P2HC.7 P?#2.7 P?#4.7 P?#6.7
USB2VCC: P2HC.8 P?#2.8 P?#4.8 P?#6.8
NetC?#2_1: C?#2.1 LM2596#1.4(U) R?#99.2 R?#130.1
NetC?#5_1: C?#5.1 LM?.4(U) R?#141.2 R?#142.1
NetC?#8_1: C?#8.1 LM2596#2.4(U) R1.1 R2.2
NetChAnd1_5: ChAnd1.5 optSupAnd1.2
NetChAnd2_5: ChAnd2.5 optSupAnd2.2
NetChAnd?#1_5: ChAnd?#1.5 optSupAnd?#1.2
NetChAnd?#2_5: ChAnd?#2.5 optSupAnd?#2.2
NetChAnd?#3_5: ChAnd?#3.5 optSupAnd?#3.2
NetChIP1_5: ChIP1.5 optSupIP1.2
NetChIP2_5: ChIP2.5 optSupIP2.2
NetChIP?#1_5: ChIP?#1.5 optSupIP?#1.2
NetChIP?#2_5: ChIP?#2.5 optSupIP?#2.2
NetChIP?#3_5: ChIP?#3.5 optSupIP?#3.2
NetChTC1_5: ChTC1.5 optSupTC1.2
NetChTC2_5: ChTC2.5 optSupTC2.2
NetChTC?#1_5: ChTC?#1.5 optSupTC?#1.2
NetChTC?#2_5: ChTC?#2.5 optSupTC?#2.2
NetChTC?#3_5: ChTC?#3.5 optSupTC?#3.2
NetChUSB1_5: ChUSB1.5 optSupUSB1.2
NetChUSB?#1_5: ChUSB?#1.5 optSupUSB?#1.2
NetChUSB?#2_5: ChUSB?#2.5 optSupUSB?#2.2
NetChUSB?#3_5: ChUSB?#3.5 optSupUSB?#3.2
NetChUSB?#4_5: ChUSB?#4.5 optSupUSB?#4.2
NetD?#1_2: D?#1.2(K) D?#5.2(K) D?#9.2(K) D?#13.2(K) D?#17.2(K) D?#21.2(K) D?#25.2(K) D?#29.2(K) D?#33.2(K) D?#37.2(K) R?#15.1
NetD?#2_2: D?#2.2(K) D?#6.2(K) D?#10.2(K) D?#18.2(K) D?#22.2(K) D?#26.2(K) D?#30.2(K) D?#34.2(K) D?#38.2(K) R?#16.1
NetD?#3_2: D?#3.2(K) D?#7.2(K) D?#11.2(K) D?#14.2(K) D?#19.2(K) D?#23.2(K) D?#27.2(K) D?#31.2(K) D?#35.2(K) D?#39.2(K) R?#17.1
NetD?#4_2: D?#4.2(K) D?#8.2(K) D?#12.2(K) D?#15.2(K) D?#16.2(K) D?#20.2(K) D?#24.2(K) D?#28.2(K) D?#32.2(K) D?#36.2(K) D?#40.2(K) R?#18.1
NetD?#41_A: D?#41.A R?#5.2
NetD?#41_C: D?#41.C(K) Q?#1.1(G) R?#1.2
NetD?#42_A: D?#42.A R?#8.2
NetD?#42_C: D?#42.C(K) Q?#2.1(G) R?#2.2
NetD?#43_A: D?#43.A R?#9.2
NetD?#43_C: D?#43.C(K) Q?#3.1(G) R?#3.2
NetD?#44_A: D?#44.A R?#11.2
NetD?#44_C: D?#44.C(K) Q?#4.1(G) R?#4.2
NetD?#45_A: D?#45.A R?#12.2
NetD?#45_C: D?#45.C(K) Q?#5.1(G) R?#6.2
NetD?#46_A: D?#46.A R?#13.2
NetD?#46_C: D?#46.C(K) Q?#6.1(G) R?#7.2
NetD?#47_A: D?#47.A R?#14.2
NetD?#47_C: D?#47.C(K) Q?#7.1(G) R?#10.2
NetD?#48_2: D?#48.2(K) Q?#8.2(D)
NetD?#49_2: D?#49.2(K) Q?#9.2(D)
NetD?#50_2: D?#50.2(K) Q?#10.2(D)
NetD?#51_2: D?#51.2(K) Q?#11.2(D)
NetD?#52_2: D?#52.2(K) Q?#12.2(D)
NetD?#53_2: D?#53.2(K) Q?#13.2(D)
NetD?#54_2: D?#54.2(K) Q?#14.2(D)
NetD?#55_2: D?#55.2(K) Q?#15.2(D)
NetD?#56_2: D?#56.2(K) Q?#16.2(D)
NetD?#57_2: D?#57.2(K) Q?#17.2(D)
NetD?#58_2: D?#58.2(K) Q?#18.2(D)
NetD?#59_2: D?#59.2(K) Q?#19.2(D)
NetD?#60_2: D?#60.2(K) Q?#20.2(D)
NetD?#61_2: D?#61.2(K) Q?#21.2(D)
NetD?#62_2: D?#62.2(K) Q?#22.2(D)
NetD?#63_2: D?#63.2(K) Q?#23.2(D)
NetD?#64_2: D?#64.2(K) Q?#24.2(D)
NetD?#65_2: D?#65.2(K) Q?#25.2(D)
NetD?#66_2: D?#66.2(K) Q?#26.2(D)
NetD?#67_2: D?#67.2(K) Q?#27.2(D)
NetD?#68_2: D?#68.2(K) Q?#28.2(D)
NetD?#69_2: D?#69.2(K) Q?#29.2(D)
NetD?#70_2: D?#70.2(K) Q?#30.2(D)
NetD?#71_2: D?#71.2(K) Q?#31.2(D)
NetD?#72_2: D?#72.2(K) Q?#32.2(D)
NetD?#73_2: D?#73.2(K) Q?#33.2(D)
NetD?#74_2: D?#74.2(K) Q?#34.2(D)
NetD?#75_2: D?#75.2(K) Q?#35.2(D)
NetD?#76_2: D?#76.2(K) Q?#36.2(D)
NetD?#77_2: D?#77.2(K) Q?#37.2(D)
NetD?#78_2: D?#78.2(K) Q?#38.2(D)
NetD?#79_2: D?#79.2(K) Q?#39.2(D)
NetD?#80_2: D?#80.2(K) Q?#40.2(D)
NetD?#81_2: D?#81.2(K) Q?#41.2(D)
NetD?#82_2: D?#82.2(K) Q?#42.2(D)
NetD?#83_2: D?#83.2(K) Q?#43.2(D)
NetD?#84_2: D?#84.2(K) Q?#44.2(D)
NetD?#85_2: D?#85.2(K) Q?#45.2(D)
NetD?#86_2: D?#86.2(K) Q?#46.2(D)
NetD?#87_2: D?#87.2(K) Q?#47.2(D)
NetD?#88_C: D?#88.C(K) L?#1.1 LM2596#1.2(G2)
NetD?#89_C: D?#89.C(K) L?#2.1 LM?.2(G2)
NetD?#90_2: D?#90.2(K) Q?#48.2(D)
NetD?#91_2: D?#91.2(K) Q?#49.2(D)
NetD?#92_2: D?#92.2(K) Q?#50.2(D)
NetD?#93_2: D?#93.2(K) Q?#51.2(D)
NetD?#94_2: D?#94.2(K) Q?#52.2(D)
NetD?#95_2: D?#95.2(K) Q?#53.2(D)
NetD?#96_2: D?#96.2(K) Q?#54.2(D)
NetD?#97_2: D?#97.2(K) Q?#55.2(D)
NetD?#98_2: D?#98.2(K) Q?#56.2(D)
NetD?#99_2: D?#99.2(K) Q?#57.2(D)
NetD?#100_2: D?#100.2(K) Q?#58.2(D)
NetD?#101_2: D?#101.2(K) Q?#59.2(D)
NetD?#102_2: D?#102.2(K) Q?#60.2(D)
NetD?#103_2: D?#103.2(K) Q?#61.2(D)
NetD?#104_2: D?#104.2(K) Q?#62.2(D)
NetD?#105_2: D?#105.2(K) Q?#63.2(D)
NetD?#106_2: D?#106.2(K) Q?#64.2(D)
NetD?#107_2: D?#107.2(K) Q?#65.2(D)
NetD?#108_2: D?#108.2(K) Q?#66.2(D)
NetD?#109_2: D?#109.2(K) Q?#67.2(D)
NetD?#110_C: D?#110.C(K) L?#3.1 LM2596#2.2(G2)
NetQ?#8_1: Q?#8.1(G) R?#19.2 R?#29.2
NetQ?#9_1: Q?#9.1(G) R?#20.2 R?#30.2
NetQ?#10_1: Q?#10.1(G) R?#21.2 R?#31.2
NetQ?#11_1: Q?#11.1(G) R?#22.2 R?#32.2
NetQ?#12_1: Q?#12.1(G) R?#23.2 R?#33.2
NetQ?#13_1: Q?#13.1(G) R?#24.2 R?#34.2
NetQ?#14_1: Q?#14.1(G) R?#25.2 R?#35.2
NetQ?#15_1: Q?#15.1(G) R?#26.2 R?#36.2
NetQ?#16_1: Q?#16.1(G) R?#27.2 R?#37.2
NetQ?#17_1: Q?#17.1(G) R?#28.2 R?#38.2
NetQ?#18_1: Q?#18.1(G) R?#39.2 R?#49.2
NetQ?#19_1: Q?#19.1(G) R?#40.2 R?#50.2
NetQ?#20_1: Q?#20.1(G) R?#41.2 R?#51.2
NetQ?#21_1: Q?#21.1(G) R?#42.2 R?#52.2
NetQ?#22_1: Q?#22.1(G) R?#43.2 R?#53.2
NetQ?#23_1: Q?#23.1(G) R?#44.2 R?#54.2
NetQ?#24_1: Q?#24.1(G) R?#45.2 R?#55.2
NetQ?#25_1: Q?#25.1(G) R?#46.2 R?#56.2
NetQ?#26_1: Q?#26.1(G) R?#47.2 R?#57.2
NetQ?#27_1: Q?#27.1(G) R?#48.2 R?#58.2
NetQ?#28_1: Q?#28.1(G) R?#59.2 R?#69.2
NetQ?#29_1: Q?#29.1(G) R?#60.2 R?#70.2
NetQ?#30_1: Q?#30.1(G) R?#61.2 R?#71.2
NetQ?#31_1: Q?#31.1(G) R?#62.2 R?#72.2
NetQ?#32_1: Q?#32.1(G) R?#63.2 R?#73.2
NetQ?#33_1: Q?#33.1(G) R?#64.2 R?#74.2
NetQ?#34_1: Q?#34.1(G) R?#65.2 R?#75.2
NetQ?#35_1: Q?#35.1(G) R?#66.2 R?#76.2
NetQ?#36_1: Q?#36.1(G) R?#67.2 R?#77.2
NetQ?#37_1: Q?#37.1(G) R?#68.2 R?#78.2
NetQ?#38_1: Q?#38.1(G) R?#79.2 R?#89.2
NetQ?#39_1: Q?#39.1(G) R?#80.2 R?#90.2
NetQ?#40_1: Q?#40.1(G) R?#81.2 R?#91.2
NetQ?#41_1: Q?#41.1(G) R?#82.2 R?#92.2
NetQ?#42_1: Q?#42.1(G) R?#83.2 R?#93.2
NetQ?#43_1: Q?#43.1(G) R?#84.2 R?#94.2
NetQ?#44_1: Q?#44.1(G) R?#85.2 R?#95.2
NetQ?#45_1: Q?#45.1(G) R?#86.2 R?#96.2
NetQ?#46_1: Q?#46.1(G) R?#87.2 R?#97.2
NetQ?#47_1: Q?#47.1(G) R?#88.2 R?#98.2
NetQ?#48_1: Q?#48.1(G) R?#100.2 R?#110.2
NetQ?#49_1: Q?#49.1(G) R?#101.2 R?#111.2
NetQ?#50_1: Q?#50.1(G) R?#102.2 R?#112.2
NetQ?#51_1: Q?#51.1(G) R?#103.2 R?#113.2
NetQ?#52_1: Q?#52.1(G) R?#104.2 R?#114.2
NetQ?#53_1: Q?#53.1(G) R?#105.2 R?#115.2
NetQ?#54_1: Q?#54.1(G) R?#106.2 R?#120.2
NetQ?#55_1: Q?#55.1(G) R?#107.2 R?#127.2
NetQ?#56_1: Q?#56.1(G) R?#108.2 R?#128.2
NetQ?#57_1: Q?#57.1(G) R?#109.2 R?#129.2
NetQ?#58_1: Q?#58.1(G) R?#116.2 R?#131.2
NetQ?#59_1: Q?#59.1(G) R?#117.2 R?#132.2
NetQ?#60_1: Q?#60.1(G) R?#118.2 R?#133.2
NetQ?#61_1: Q?#61.1(G) R?#119.2 R?#134.2
NetQ?#62_1: Q?#62.1(G) R?#121.2 R?#135.2
NetQ?#63_1: Q?#63.1(G) R?#122.2 R?#136.2
NetQ?#64_1: Q?#64.1(G) R?#123.2 R?#137.2
NetQ?#65_1: Q?#65.1(G) R?#124.2 R?#138.2
NetQ?#66_1: Q?#66.1(G) R?#125.2 R?#139.2
NetQ?#67_1: Q?#67.1(G) R?#126.2 R?#140.2
NetQ?#68_1: Q?#68.1(D) R?#143.1 R?#144.1
NetQ?#69_1: Q?#69.1(D) R?#145.1 R?#146.1
NetQ?#70_1: Q?#70.1(D) R?#147.1 R?#148.1
NetQ?#71_1: Q?#71.1(D) R?#149.1 R?#150.1
NetQ?#72_1: Q?#72.1(D) R?#151.1 R?#152.1
NetQ?#73_1: Q?#73.1(D) R?#153.1 R?#154.1
NetQ?#74_1: Q?#74.1(D) R?#155.1 R?#156.1
NetQ?#75_1: Q?#75.1(D) R?#157.1 R?#158.1
NetQ?#76_1: Q?#76.1(D) R?#159.1 R?#160.1
NetQ?#77_1: Q?#77.1(D) R?#161.1 R?#162.1
NetQ?#78_1: Q?#78.1(D) R?#163.1 R?#164.1
NetQ?#79_1: Q?#79.1(D) R?#165.1 R?#166.1
NetQ?#80_1: Q?#80.1(D) R?#167.1 R?#168.1
NetQ?#81_1: Q?#81.1(D) R?#169.1 R?#170.1

Not connected (* = marked no-connect by the designer): P?#8 1 2

## Notes on the sheet
- Title
- Size:
- Date:
- File:
- A0
- Number:
- Time:
- Revision:
- Sheet
- of
- (in symbol CAP) 16V

## Library data of the parts
5VSupply 12VSupply ACSout = 6-1123723-2: 3.96 EP HDR ASSY 2P_GREEN_; MF: TE Connectivity; Number_of_Positions: 2; Product_Type: Header; Centerline_Pitch: 3.96 mm[.156 in]; TE_purchase_URL: https://www.te.com/usa-en/product-6-1123723-2.html?te_bu=Cor&te_type=disp&te_campaign=seda_glo_cor-seda-global-disp-prtnr-fy19-seda-model-bom-cta_sma-317_1&elqCampaignId=32493; MP: 6-1123723-2; Price: None; Availability: Unavailable; Package: None; EU_RoHS_Compliance: Compliant; SnapEDA_Link: https://www.snapeda.com/parts/6-1123723-2/TE%20Connectivity%20AMP%20Connectors/view-part/?ref=snap; Value: *
ArdPin P1HC P2HC P?#2 P?#4 P?#6 = Header 10: Header, 10-Pin; LatestRevisionDate: 17-Jul-2002; LatestRevisionNote: Re-released for DXP Platform.; Publisher: Altium Limited
C1 C?#1 C?#3 C?#4 C?#6 C?#7 = CAP
C?#2 C?#5 C?#8 = CAP NON
ChAnd1 ChAnd2 ChAnd?#1-ChAnd?#3 ChIP1 ChIP2 ChIP?#1-ChIP?#3 ChTC1 ChTC2 ChTC?#1-ChTC?#3 ChUSB1 ChUSB?#1-ChUSB?#4 = Header 5: ورودی از شارژر اندرویید; LatestRevisionDate: 17-Jul-2002; LatestRevisionNote: Re-released for DXP Platform.; Publisher: Altium Limited
D?#1-D?#40 D?#48-D?#87 D?#90-D?#109 = STPS2L60A: SCHOTTKY RECTIFIER 2A; Voltage Vrrm: 60V; Diode Case Style: DO-214AC; Case Style: DO-214AC; pin to pad: 1>A 2>A; MF: STMicroelectronics; Price: None; Availability: Unavailable; SnapEDA_Link: https://www.snapeda.com/parts/STPS2L60A/STMicroelectronics/view-part/?ref=snap; Package: DO-214 STMicroelectronics; MP: STPS2L60A; Value: *
D?#41-D?#47 D?#88 D?#89 D?#110 = S1M: S1 Series 1000 V 1 A 1 uA Surface Mount General Purpose Rectifier - DO-214AC; MF: ON Semiconductor; Price: None; Availability: Unavailable; SnapEDA_Link: https://www.snapeda.com/parts/S1M/ON%20Semiconductor/view-part/?ref=snap; Package: DO-214AC-214 ON Semiconductor; MP: S1M; Value: *
JAnd1 JAnd2 JAnd?#1-JAnd?#3 JIP1 JIP2 JIP?#1-JIP?#3 JTC1 JTC2 JTC?#1-JTC?#3 JUSB1 JUSB?#1-JUSB?#4 = Header 3: جامپر انتخاب بین 5 ثابت خروجی (منبع تغذیه ثابت) یا انتخاب خروجی شارژر برای قفسه; LatestRevisionDate: 17-Jul-2002; LatestRevisionNote: Re-released for DXP Platform.; Publisher: Altium Limited
L?#1-L?#3 = Inductor
LM2596#1 LM2596#2 LM? = MOSFET-N3: Two-Gate, N-Channel MOSFET, Externally Terminated Substrate; Published: 24-Mar-1999; LatestRevisionDate: 17-Jul-2002; LatestRevisionNote: Re-released for DXP Platform.; PackageReference: T05A; Publisher: Altium Limited; PackageDescription: TO-220, Molded, 5 Lead, Straight; Code_JEDEC: TS-001-AA
optSupAnd1 optSupAnd2 optSupAnd?#1-optSupAnd?#3 optSupIP1 optSupIP2 optSupIP?#1-optSupIP?#3 optSupTC1 optSupTC2 optSupTC?#1-optSupTC?#3 optSupUSB1 optSupUSB?#1-optSupUSB?#4 = Header 2: اگر شارژر ورودی 12 ولت داشته باشد این جامپر 12 ولت بایستی وصل شود; LatestRevisionDate: 17-Jul-2002; LatestRevisionNote: Re-released for DXP Platform.; Publisher: Altium Limited
P1LC P2LC P?#1 P?#3 P?#5 = Header 20X2: Header, 20-Pin, Dual row; LatestRevisionDate: 17-Jul-2002; LatestRevisionNote: Re-released for DXP Platform.; Publisher: Altium Limited
P?#7 P?#8 = Header 2: Header, 2-Pin; LatestRevisionDate: 17-Jul-2002; LatestRevisionNote: Re-released for DXP Platform.; Publisher: Altium Limited
P?#9 = Header 3: Header, 3-Pin; LatestRevisionDate: 17-Jul-2002; LatestRevisionNote: Re-released for DXP Platform.; Publisher: Altium Limited
Q?#1-Q?#67 = IPD50P04P4L-11: P-Channel 40 V 10.6 mOhm OptiMOSآ®-P2 Power-Transistor -PG-TO-252-3; MF: Infineon Technologies; MP: IPD50P04P4L-11; Package: TO-252-3 Infineon; Price: None; Availability: Unavailable; SnapEDA_Link: https://www.snapeda.com/parts/IPD50P04P4L-11/Infineon%20Technologies/view-part/?ref=snap; Value: *
Q?#68-Q?#81 = MOSFET-P: P-Channel MOSFET; Published: 8-Jun-2000; LatestRevisionDate: 17-Jul-2002; LatestRevisionNote: Re-released for DXP Platform.; PackageVersion: 1995/1996; PackageReference: E3; Publisher: Altium Limited; PackageDescription: TO, Flat Index; 3 In-Line, Axial Leads; Body Dia. 4.6mm; Lead Dia. 0.5 mm (max)
R1 R2 R?#99 R?#130 R?#141 R?#142 = RESISTOR
R?#1-R?#98 R?#100-R?#129 R?#131-R?#140 R?#143-R?#170 = Res1: Resistor; Published: 8-Jun-2000; LatestRevisionDate: 17-Jul-2002; LatestRevisionNote: Re-released for DXP Platform.; PackageReference: AXIAL-0.3; Publisher: Altium Limited; PackageDescription: Axial Device, Thru-Hole; 2 Leads; 0.3 in Pin Spacing
SR1-SR16 = Res Pack3: Isolated Resistor Network; Published: 24-Mar-1999; LatestRevisionDate: 29-May-2009; LatestRevisionNote: IPC-7351 Footprint Added.; PackageReference: SO-16; Publisher: Altium Limited; PackageDescription: 16-Pin Small Outline Integrated Circuit 1.27 mm Pitch; Code_JEDEC: MS-012-AC; Code_IPC: SOIC127P600-16